# Altium project master.PrjPcb (part 2 of 3)

## Sheet mcu0_to_mcu1_isolated_SPI.SchDoc: foxBMS BMS-Master
size A3; DocumentNumber: 12; SheetNumber: 12; SheetTotal: 24; Author: Fraunhofer IISB foxBMS Team; REL-DATE: 2017-05-16; VERSION: 1.0.2; SheetDescription: Isolated Bidirectional Interface MCU0/MCU1
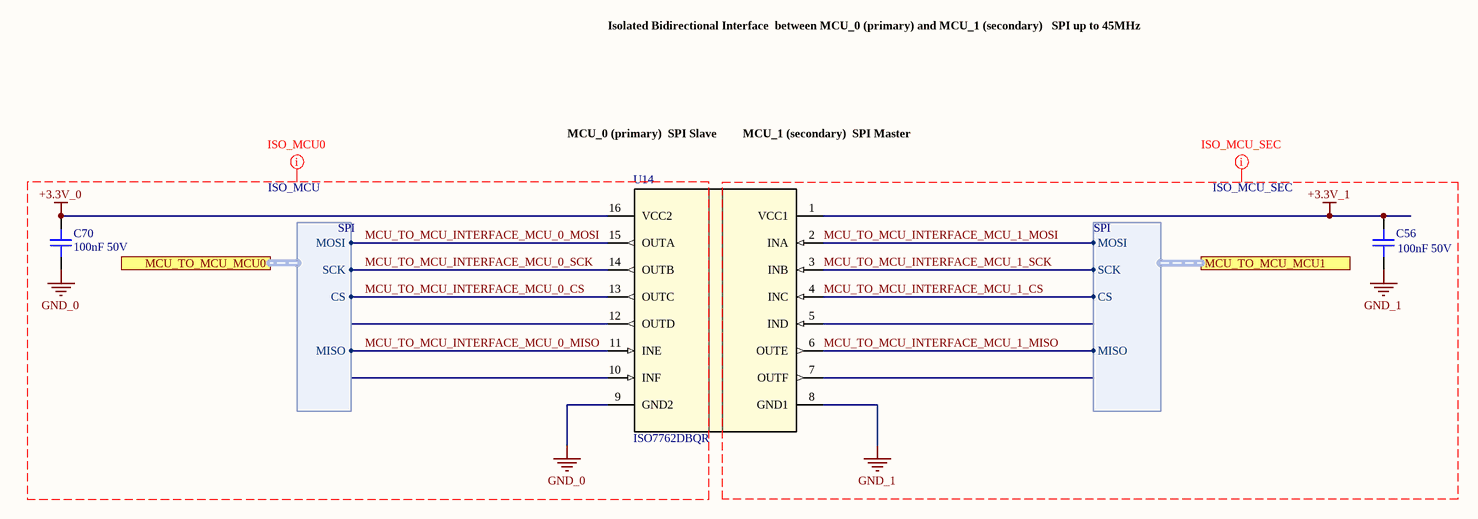
[diagram p7: mcu0_to_mcu1_isolated_SPI.SchDoc]

### Parts
C56  100nF 50V  [0603C]
C70  100nF 50V  [0603C]
U14  ISO7762DBQR  [DBQ0016A_N]

### Ports
MCU_TO_MCU_MCU0 (harness SPI), MCU_TO_MCU_MCU1 (harness SPI)

### Harnesses
SPI: CS, MISO, MOSI, SCK

### Nets
+3.3V_0: C70.2 U14.16(VCC2)
+3.3V_1: C56.1 U14.1(VCC1)
GND_0: C70.1 U14.9(GND2)
GND_1: C56.2 U14.8(GND1)
MCU_TO_MCU_INTERFACE_MCU_0_CS: U14.13(OUTC) ; port MCU_TO_MCU_MCU0.CS
MCU_TO_MCU_INTERFACE_MCU_0_MISO: U14.11(INE) ; port MCU_TO_MCU_MCU0.MISO
MCU_TO_MCU_INTERFACE_MCU_0_MOSI: U14.15(OUTA) ; port MCU_TO_MCU_MCU0.MOSI
MCU_TO_MCU_INTERFACE_MCU_0_SCK: U14.14(OUTB) ; port MCU_TO_MCU_MCU0.SCK
MCU_TO_MCU_INTERFACE_MCU_1_CS: U14.4(INC) ; port MCU_TO_MCU_MCU1.CS
MCU_TO_MCU_INTERFACE_MCU_1_MISO: U14.6(OUTE) ; port MCU_TO_MCU_MCU1.MISO
MCU_TO_MCU_INTERFACE_MCU_1_MOSI: U14.2(INA) ; port MCU_TO_MCU_MCU1.MOSI
MCU_TO_MCU_INTERFACE_MCU_1_SCK: U14.3(INB) ; port MCU_TO_MCU_MCU1.SCK

Not connected (* = marked no-connect by the designer): U14 5(IND) 7(OUTF) 10(INF) 12(OUTD)

### Layout directives
net class ISO_MCU_SEC: +3.3V_1, GND_1, MCU_TO_MCU_INTERFACE_MCU_1_CS, MCU_TO_MCU_INTERFACE_MCU_1_MISO, MCU_TO_MCU_INTERFACE_MCU_1_MOSI, MCU_TO_MCU_INTERFACE_MCU_1_SCK
net class ISO_MCU: +3.3V_0, GND_0, MCU_TO_MCU_INTERFACE_MCU_0_CS, MCU_TO_MCU_INTERFACE_MCU_0_MISO, MCU_TO_MCU_INTERFACE_MCU_0_MOSI, MCU_TO_MCU_INTERFACE_MCU_0_SCK

### Notes on the sheet
- Isolated Bidirectional Interface
  between MCU_0 (primary) and MCU_1 (secondary)
  SPI up to 45MHz
- MCU_0 (primary)
  SPI Slave
- MCU_1 (secondary)
  SPI Master
- Fraunhofer IISB
- Schottkystr. 10
- developed by:
- 91058 Erlangen
- Germany
- Author
- Project
- License
- Description
- File
- Version
- Release Date
- Sheet
- www.foxbms.org
- www.iisb.fraunhofer.de
- foxBMS Team
- /

### Library data of the parts
C56 C70 = gen_C_ceramic_100n_50V_X7R_0603: as C128 on sheet FPGA_SPI_interface; Rated Voltage: 50V; Dielectric: X7R; Supplier 1: Digi-Key; Supplier Part Number 1: 490-5798-1-ND; Height - Seated (Max): 0.8mm; Mounting Type: SurfaceMount,MLCC; Operating Temperature: –55 to 125°C; Series: GCJ; Tolerance: ±10%; Manufacturer_Part_Number: GCJ188R71H104KA12
U14 = ISO7762DBQR: Imported; Manufacturer: Texas Instruments; PartNumber: ISO7760DBQR; RefDes: RefDes; TYPE: TYPE; Value: Value

## Sheet isolated_USB.SchDoc: foxBMS BMS-Master
size A3; DocumentNumber: 19; SheetNumber: 19; SheetTotal: 24; Author: Fraunhofer IISB foxBMS Team; REL-DATE: 2017-05-16; VERSION: 1.0.2; SheetDescription: Isolated USB MCU_0 + MCU_1
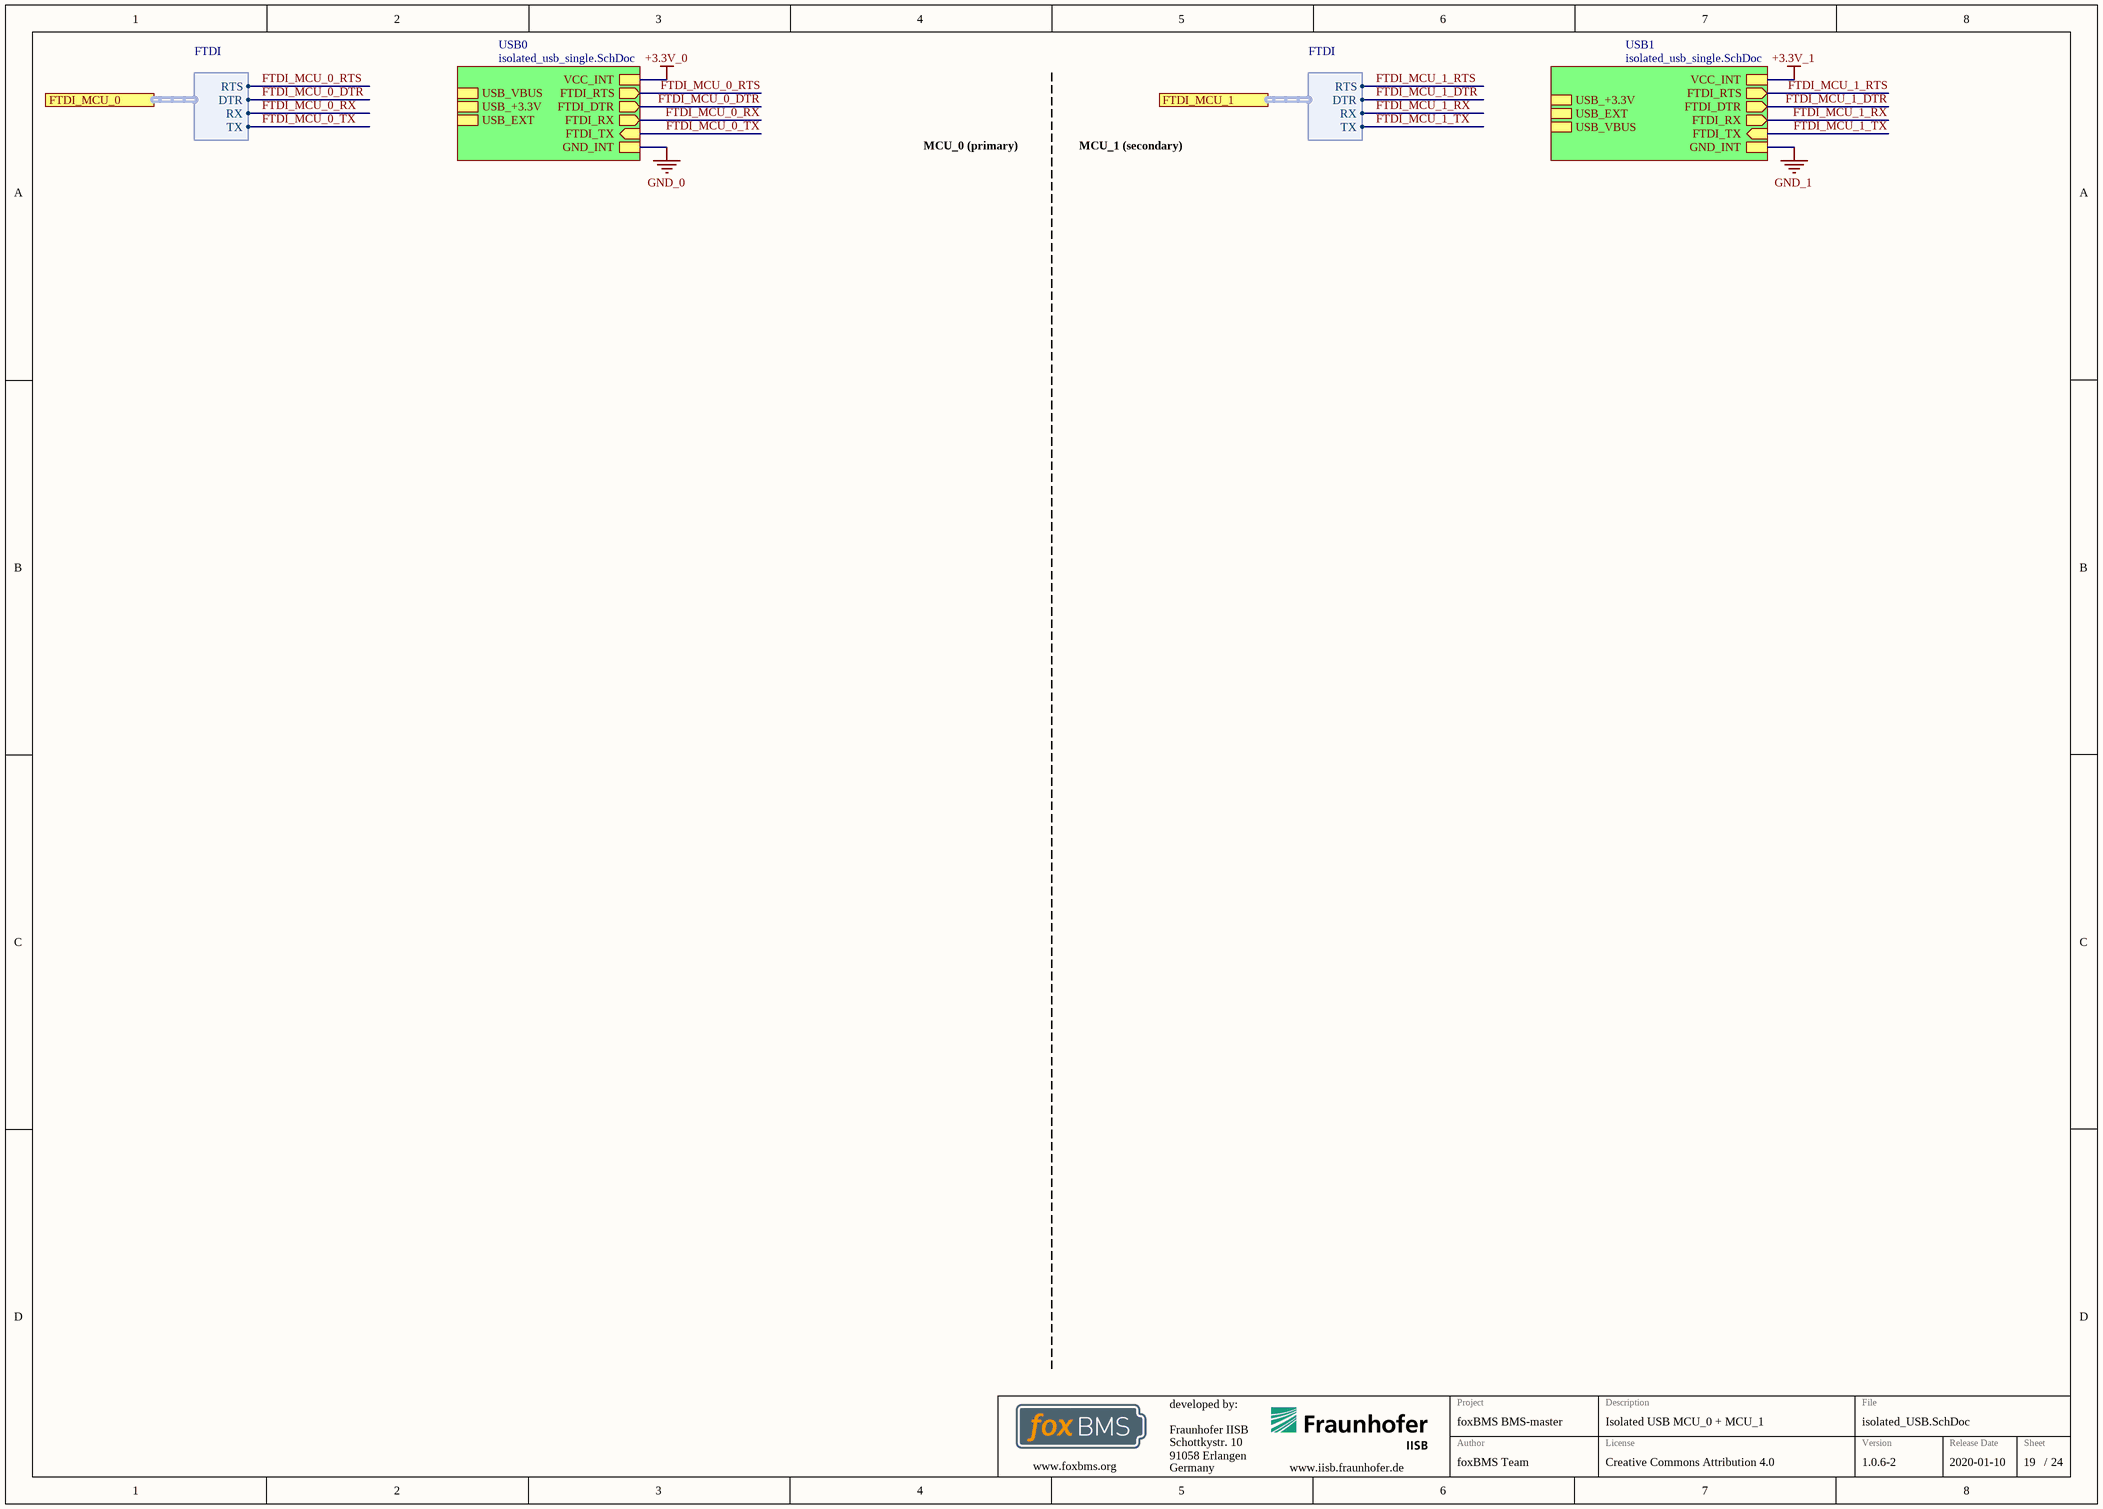
[diagram p8: isolated_USB.SchDoc]

### Sub-sheets
USB0 = isolated_usb_single.SchDoc (file not in this document): FTDI_TX (in), FTDI_RX (out), FTDI_DTR (out), FTDI_RTS (out), VCC_INT, GND_INT, USB_VBUS, USB_+3.3V, USB_EXT
USB1 = isolated_usb_single.SchDoc (file not in this document): FTDI_TX (in), FTDI_RX (out), FTDI_DTR (out), FTDI_RTS (out), VCC_INT, GND_INT, USB_+3.3V, USB_EXT, USB_VBUS

### Ports
FTDI_MCU_0 (harness FTDI), FTDI_MCU_1 (harness FTDI)

### Harnesses
FTDI: RTS, DTR, RX, TX

### Nets
FTDI_MCU_0_DTR: sheet USB0/FTDI_DTR, port FTDI_MCU_0.DTR
FTDI_MCU_0_RTS: sheet USB0/FTDI_RTS, port FTDI_MCU_0.RTS
FTDI_MCU_0_RX: sheet USB0/FTDI_RX, port FTDI_MCU_0.RX
FTDI_MCU_0_TX: sheet USB0/FTDI_TX, port FTDI_MCU_0.TX
FTDI_MCU_1_DTR: sheet USB1/FTDI_DTR, port FTDI_MCU_1.DTR
FTDI_MCU_1_RTS: sheet USB1/FTDI_RTS, port FTDI_MCU_1.RTS
FTDI_MCU_1_RX: sheet USB1/FTDI_RX, port FTDI_MCU_1.RX
FTDI_MCU_1_TX: sheet USB1/FTDI_TX, port FTDI_MCU_1.TX

### Notes on the sheet
- MCU_0 (primary)
- MCU_1 (secondary)
- Fraunhofer IISB
- Schottkystr. 10
- developed by:
- 91058 Erlangen
- Germany
- Author
- Project
- License
- Description
- File
- Version
- Release Date
- Sheet
- www.foxbms.org
- www.iisb.fraunhofer.de
- foxBMS Team
- /

## Sheet mcu1_secondary.SchDoc: foxBMS BMS-Master
size A3; DocumentNumber: 11; SheetNumber: 11; SheetTotal: 24; Author: Fraunhofer IISB foxBMS Team; REL-DATE: 2017-05-16; VERSION: 1.0.2; SheetDescription: MCU1 (Secondary); ClassName: ISO_MCU_SEC
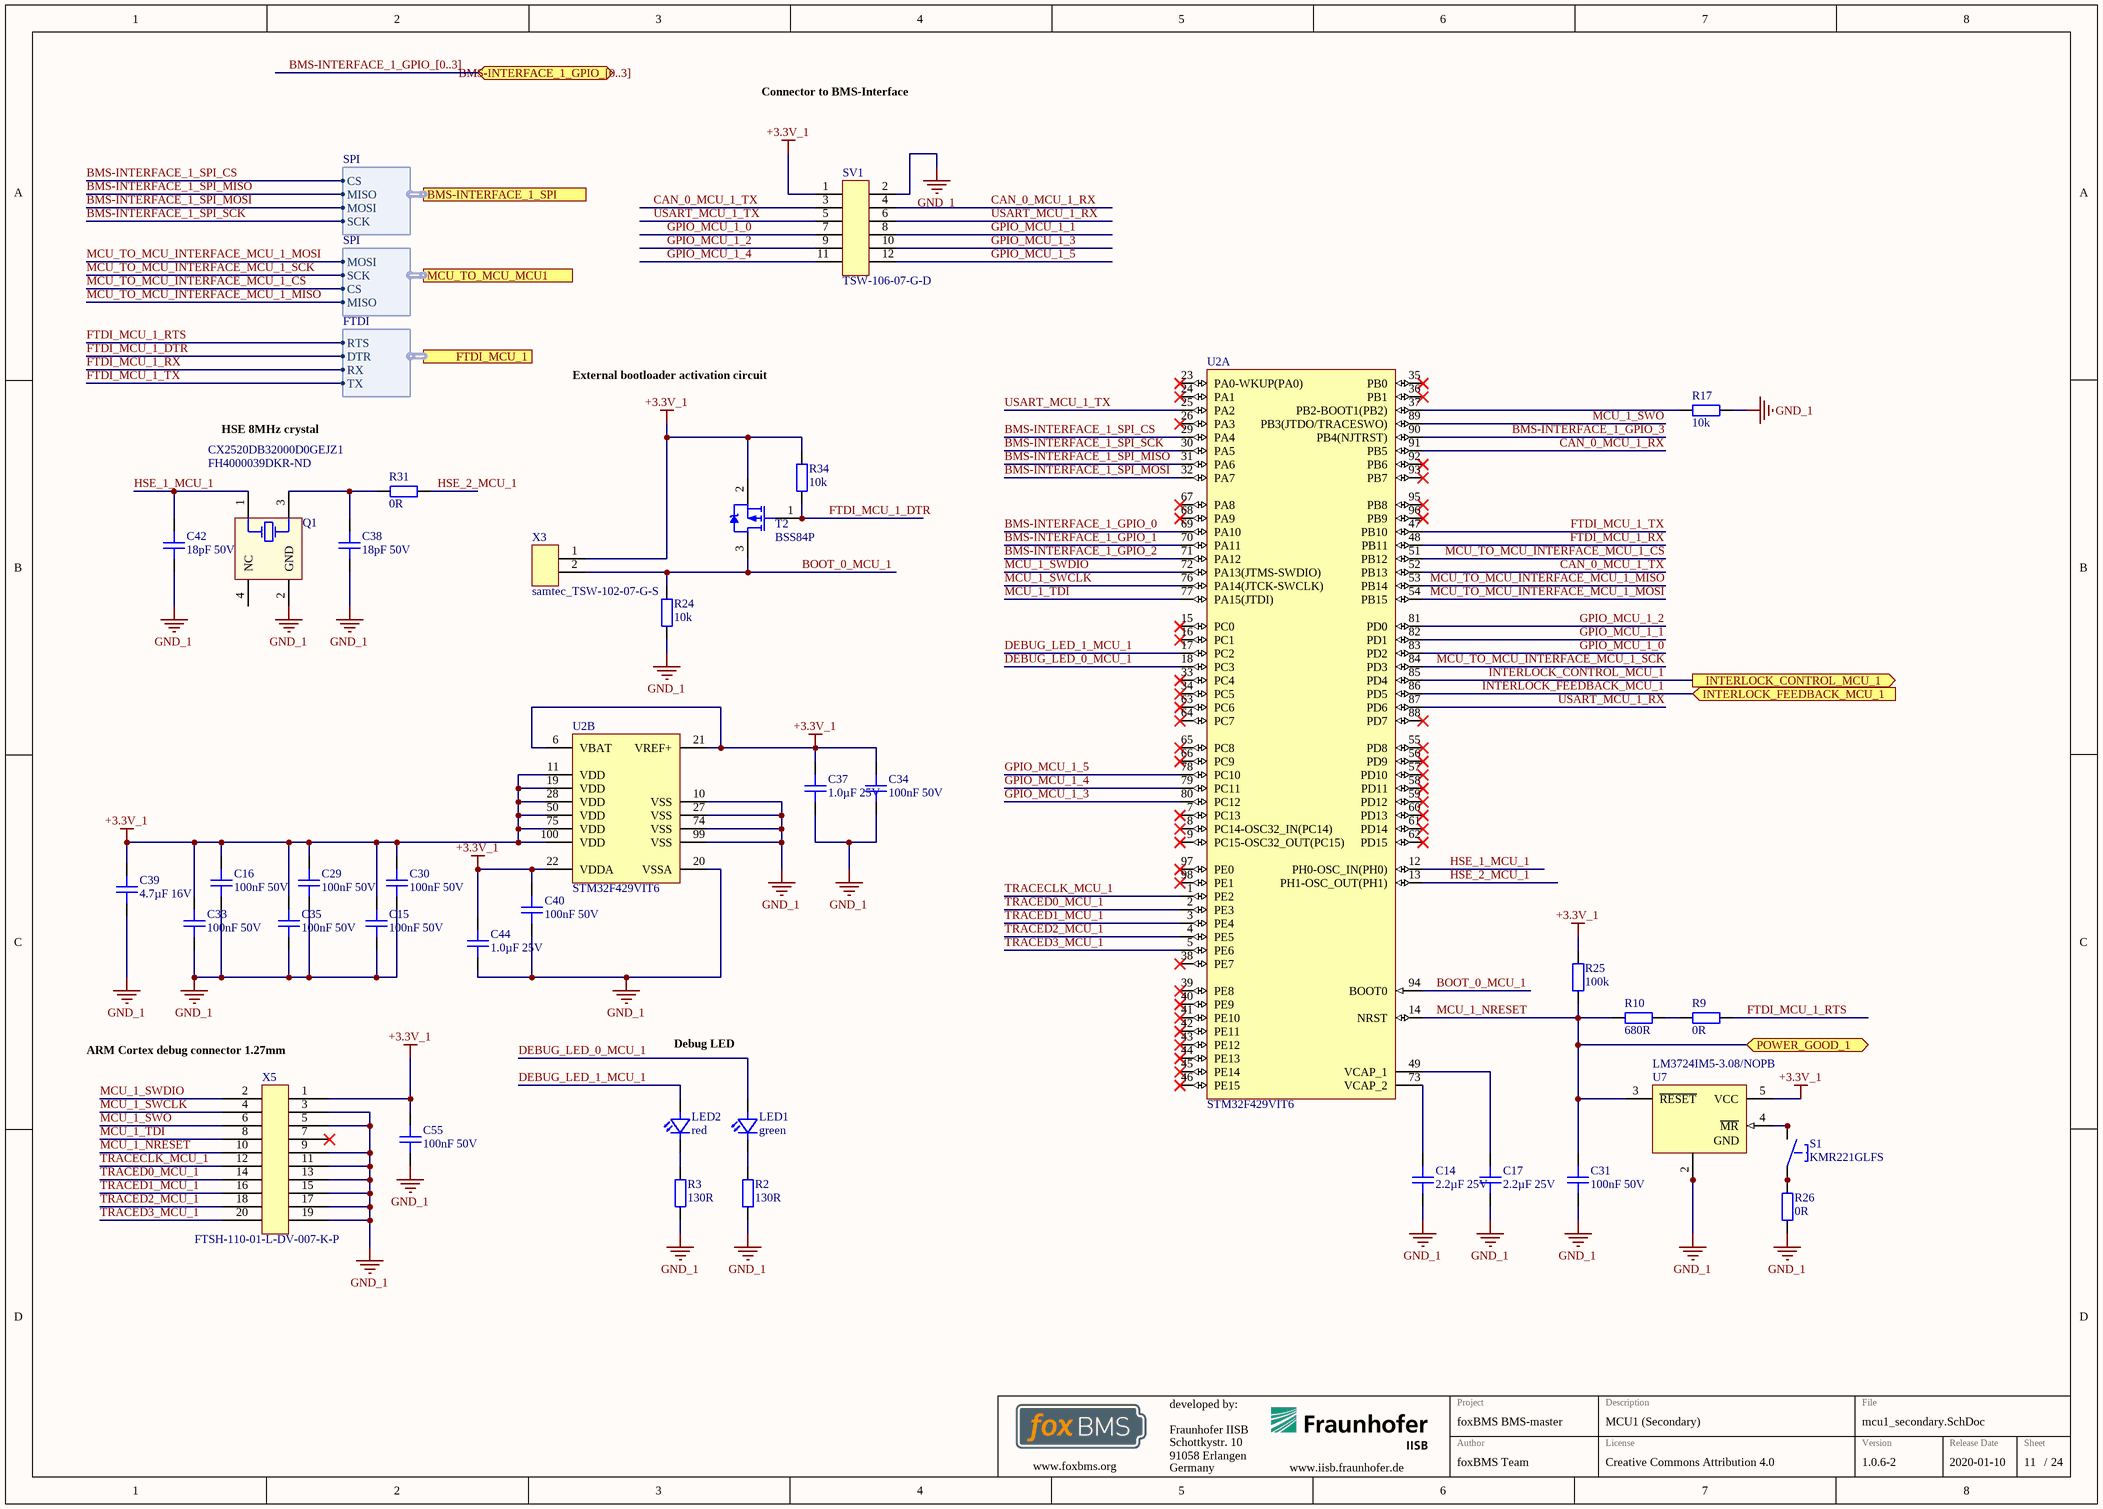
[diagram p9: mcu1_secondary.SchDoc]

### Parts
C14  2.2µF 25V  [0805C]
C15  100nF 50V  [0402C]
C16  100nF 50V  [0402C]
C17  2.2µF 25V  [0805C]
C29  100nF 50V  [0402C]
C30  100nF 50V  [0402C]
C31  100nF 50V  [0603C]
C33  100nF 50V  [0402C]
C34  100nF 50V  [0402C]
C35  100nF 50V  [0402C]
C37  1.0µF 25V  [0603C]
C38  18pF 50V  [0402C]
C39  4.7µF 16V  [0805C]
C40  100nF 50V  [0402C]
C42  18pF 50V  [0402C]
C44  1.0µF 25V  [0603C]
C55  100nF 50V  [0603C]
LED1  green  [LEDC1608X07N]
LED2  red  [LEDC1608X07N]
Q1  CX2520DB32000D0GEJZ1  Supplier Part Number 1: FH4000039DKR-ND  [AVX-CX2520DB32000D0GEJZ1-4_V]
R2  130R  [0603R]
R3  130R  [0603R]
R9  0R  [0603R]
R10  680R  [0603R]
R17  10k  [0603R]
R24  10k  [0603R]
R25  100k  [0603R]
R26  0R  [0603R]
R31  0R  [0402R]
R34  10k  [0603R]
S1  KMR221GLFS  [KMR2_Series]
SV1  TSW-106-07-G-D  [Pinheader_2.54_2x6]
T2  BSS84P  [INF-PG-SOT23_N]
U2  STM32F429VIT6  [STM-LQFP100_N]  (parts A,B of 2)
U7  LM3724IM5-3.08/NOPB  [MF05A_N]
X3  samtec_TSW-102-07-G-S  [Pinheader_2.54_2]
X5  FTSH-110-01-L-DV-007-K-P  [CORTEX_DEBUG_20_PIN]

### Ports
BMS-INTERFACE_1_GPIO_[0..3] (bidir), BMS-INTERFACE_1_SPI (harness SPI), FTDI_MCU_1 (harness FTDI), INTERLOCK_CONTROL_MCU_1 (out), INTERLOCK_FEEDBACK_MCU_1 (in), MCU_TO_MCU_MCU1 (harness SPI), POWER_GOOD_1 (bidir)

### Harnesses
SPI: CS, MISO, MOSI, SCK
FTDI: RTS, DTR, RX, TX

### Nets
+3.3V_1: C15.1 C16.1 C29.1 C30.1 C33.1 C34.1 C35.1 C37.1 C39.1 C40.1 C44.1 C55.1 R25.2 R34.2 SV1.1 T2.2(SOURCE) U2.6(VBAT) U2.11(VDD) U2.19(VDD) U2.21(VREF+) U2.22(VDDA) U2.28(VDD) U2.50(VDD) U2.75(VDD) U2.100(VDD) U7.5(VCC) X3.1 X5.1
GND_1: C14.2 C15.2 C16.2 C17.2 C29.2 C30.2 C31.2 C33.2 C34.2 C35.2 C37.2 C38.2 C39.2 C40.2 C42.1 C44.2 C55.2 Q1.2(GND) R2.1 R3.1 R17.1 R24.1 R26.1 SV1.2 U2.10(VSS) U2.20(VSSA) U2.27(VSS) U2.74(VSS) U2.99(VSS) U7.1(GND) U7.2(GND) X5.3 X5.5 X5.9 X5.11 X5.13 X5.15 X5.17 X5.19
BMS-INTERFACE_1_GPIO_0: U2.69(PA10)
BMS-INTERFACE_1_GPIO_1: U2.70(PA11)
BMS-INTERFACE_1_GPIO_2: U2.71(PA12)
BMS-INTERFACE_1_GPIO_3: U2.90(PB4(NJTRST))
BMS-INTERFACE_1_SPI_CS: U2.29(PA4) ; port BMS-INTERFACE_1_SPI.CS
BMS-INTERFACE_1_SPI_MISO: U2.31(PA6) ; port BMS-INTERFACE_1_SPI.MISO
BMS-INTERFACE_1_SPI_MOSI: U2.32(PA7) ; port BMS-INTERFACE_1_SPI.MOSI
BMS-INTERFACE_1_SPI_SCK: U2.30(PA5) ; port BMS-INTERFACE_1_SPI.SCK
BOOT_0_MCU_1: R24.2 T2.3(DRAIN) U2.94(BOOT0) X3.2
CAN_0_MCU_1_RX: SV1.4 U2.91(PB5)
CAN_0_MCU_1_TX: SV1.3 U2.52(PB13)
DEBUG_LED_0_MCU_1: LED1.2(A) U2.18(PC3)
DEBUG_LED_1_MCU_1: LED2.2(A) U2.17(PC2)
FTDI_MCU_1_DTR: R34.1 T2.1(GATE) ; port FTDI_MCU_1.DTR
FTDI_MCU_1_RTS: R9.2 ; port FTDI_MCU_1.RTS
FTDI_MCU_1_RX: U2.48(PB11) ; port FTDI_MCU_1.RX
FTDI_MCU_1_TX: U2.47(PB10) ; port FTDI_MCU_1.TX
GPIO_MCU_1_0: SV1.7 U2.83(PD2)
GPIO_MCU_1_1: SV1.8 U2.82(PD1)
GPIO_MCU_1_2: SV1.9 U2.81(PD0)
GPIO_MCU_1_3: SV1.10 U2.80(PC12)
GPIO_MCU_1_4: SV1.11 U2.79(PC11)
GPIO_MCU_1_5: SV1.12 U2.78(PC10)
HSE_1_MCU_1: C42.2 Q1.1(HOT) U2.12(PH0-OSC_IN(PH0))
HSE_2_MCU_1: R31.1 U2.13(PH1-OSC_OUT(PH1))
INTERLOCK_CONTROL_MCU_1: U2.85(PD4) ; port INTERLOCK_CONTROL_MCU_1
INTERLOCK_FEEDBACK_MCU_1: U2.86(PD5) ; port INTERLOCK_FEEDBACK_MCU_1
MCU_1_NRESET: C31.1 R10.1 R25.1 U2.14(NRST) U7.3(~{RESET}) X5.10 ; port POWER_GOOD_1
MCU_1_SWCLK: U2.76(PA14(JTCK-SWCLK)) X5.4
MCU_1_SWDIO: U2.72(PA13(JTMS-SWDIO)) X5.2
MCU_1_SWO: U2.89(PB3(JTDO/TRACESWO)) X5.6
MCU_1_TDI: U2.77(PA15(JTDI)) X5.8
MCU_TO_MCU_INTERFACE_MCU_1_CS: U2.51(PB12) ; port MCU_TO_MCU_MCU1.CS
MCU_TO_MCU_INTERFACE_MCU_1_MISO: U2.53(PB14) ; port MCU_TO_MCU_MCU1.MISO
MCU_TO_MCU_INTERFACE_MCU_1_MOSI: U2.54(PB15) ; port MCU_TO_MCU_MCU1.MOSI
MCU_TO_MCU_INTERFACE_MCU_1_SCK: U2.84(PD3) ; port MCU_TO_MCU_MCU1.SCK
TRACECLK_MCU_1: U2.1(PE2) X5.12
TRACED0_MCU_1: U2.2(PE3) X5.14
TRACED1_MCU_1: U2.3(PE4) X5.16
TRACED2_MCU_1: U2.4(PE5) X5.18
TRACED3_MCU_1: U2.5(PE6) X5.20
USART_MCU_1_RX: SV1.6 U2.87(PD6)
USART_MCU_1_TX: SV1.5 U2.25(PA2)
NetC14_1: C14.1 U2.73(VCAP_2)
NetC17_1: C17.1 U2.49(VCAP_1)
NetC38_1: C38.1 Q1.3(HOT) R31.2
NetLED1_1: LED1.1(C) R2.2
NetLED2_1: LED2.1(C) R3.2
NetR9_1: R9.1 R10.2
NetR17_2: R17.2 U2.37(PB2-BOOT1(PB2))
NetR26_2: R26.2 S1.1 S1.2
NetS1_3: S1.3 S1.4 U7.4(~{MR})

Not connected (* = marked no-connect by the designer): Q1 4(NC); U2 7(PC13)* 8(PC14-OSC32_IN(PC14))* 9(PC15-OSC32_OUT(PC15))* 15(PC0)* 16(PC1)* 23(PA0-WKUP(PA0))* 24(PA1)* 26(PA3)* 33(PC4)* 34(PC5)* 35(PB0)* 36(PB1)* 38(PE7)* 39(PE8)* 40(PE9)* 41(PE10)* 42(PE11)* 43(PE12)* 44(PE13)* 45(PE14)* 46(PE15)* 55(PD8)* 56(PD9)* 57(PD10)* 58(PD11)* 59(PD12)* 60(PD13)* 61(PD14)* 62(PD15)* 63(PC6)* 64(PC7)* 65(PC8)* 66(PC9)* 67(PA8)* 68(PA9)* 88(PD7)* 92(PB6)* 93(PB7)* 95(PB8)* 96(PB9)* 97(PE0)* 98(PE1)*; X5 7*

### Buses and harness runs
bus BMS-INTERFACE_1_GPIO_[0..3] = port BMS-INTERFACE_1_GPIO_[0..3]

### Notes on the sheet
- Connector to BMS-Interface
- External bootloader activation circuit
- HSE 8MHz crystal
- (near X5) ARM Cortex debug connector 1.27mm
- Debug LED
- Fraunhofer IISB
- Schottkystr. 10
- developed by:
- 91058 Erlangen
- Germany
- Author
- Project
- License
- Description
- File
- Version
- Release Date
- Sheet
- www.foxbms.org
- www.iisb.fraunhofer.de
- foxBMS Team
- /

### Library data of the parts
C14 C17 = gen_C_ceramic_2u2_50V_X7R_0805: Ceramic, 2.2µF, ±10%, 25V, X7R, –55 to 125°C, 0805 (2012),RoHS, Automotive; Part Number: GCJ21BR71E225KA01; Manufacturer: Murata; Capacitance: 2u2; Case EIA: 0805; Case Metric: 2012; Automotive Qualified: True; PnP Package: C_0805_10; PnP Value: 2.2µF/25V/X7R; Rated Voltage: 25V; Dielectric: X7R; Height - Seated (Max): 1.25mm; Mounting Type: SurfaceMount,MLCC; Operating Temperature: –55 to 125°C; Series: GCJ; Tolerance: ±10%; Manufacturer_Part_Number: GCJ21BR71E225KA01
C15 C16 C29 C30 C33-C35 = gen_C_ceramic_100n_50V_X7R_0402: Ceramic, 100nF, ±10%, 50V, X7R, –55 to 125°C, 0402 (1005),RoHS, Automotive; Part Number: GCM155R71H104KE02; Manufacturer: Murata; Capacitance: 100n; Case EIA: 0402; Case Metric: 1005; PnP Package: C_0402_10; PnP Value: 100nF/50V/X7R; Automotive Qualified: True; PnP equipped: x; Rated Voltage: 50V; Dielectric: X7R; Supplier 1: Digi-Key; Supplier Part Number 1: 490-10672-1-ND; Height - Seated (Max): 0.5mm; Mounting Type: SurfaceMount,MLCC; Operating Temperature: –55 to 125°C; Series: GCM; Tolerance: ±10%; Manufacturer_Part_Number: GCM155R71H104KE02
C31 C55 = gen_C_ceramic_100n_50V_X7R_0603: as C128 on sheet FPGA_SPI_interface; Rated Voltage: 50V; Dielectric: X7R; Supplier 1: Digi-Key; Supplier Part Number 1: 490-5798-1-ND; Height - Seated (Max): 0.8mm; Mounting Type: SurfaceMount,MLCC; Operating Temperature: –55 to 125°C; Series: GCJ; Tolerance: ±10%; Manufacturer_Part_Number: GCJ188R71H104KA12
C37 C44 = gen_C_ceramic_1u_25V_X7R_0603: as C122 on sheet power; Rated Voltage: 25V; Dielectric: X7R; Supplier 1: Digi-Key; Supplier Part Number 1: 490-14409-1-ND; Height - Seated (Max): 0.8mm; Mounting Type: SurfaceMount,MLCC; Operating Temperature: –55 to 125°C; Series: GCJ; Tolerance: ±10%; Manufacturer_Part_Number: GCJ188R71E105KA01
C38 C42 = gen_C_ceramic_18p_50V_C0G_0402: Ceramic, 18pF, ±5%, 50V, X7R, 25 to 125°C, 0402 (1005),RoHS, Automotive; Part Number: GCM1555C1H180JA16#; Manufacturer: Murata; Capacitance: 18p; Dielectric: C0G; Case EIA: 0402; Case Metric: 1005; Automotive Qualified: True; PnP Package: C_0402_10; PnP Value: 18pF/50V/X7R; Rated Voltage: 50V; Supplier 1: Digi-Key; Supplier Part Number 1: 490-12650-1-ND; Height - Seated (Max): 0.5mm; Mounting Type: SurfaceMount,MLCC; Operating Temperature: 25 to 125°C; Series: GCM; Tolerance: ±5%; Manufacturer_Part_Number: GCM1555C1H180JA16#
C39 = gen_C_ceramic_4u7_16V_X7R_0805: Ceramic, 4.7µF, ±10%, 16V, X7R, –55 to 125°C, 0805 (2012),RoHS, Automotive; Part Number: GCJ21BR71C475KA01; Manufacturer: Murata; Capacitance: 4u7; Case EIA: 0805; Case Metric: 2012; AVT Set: x; Automotive Qualified: True; PnP Package: C_0805_10; PnP Value: 4.7µF/16V/X7R; Rated Voltage: 16V; Dielectric: X7R; Supplier 1: Digi-Key; Supplier Part Number 1: 490-10557-1-ND; Height - Seated (Max): 1.25mm; Mounting Type: SurfaceMount,MLCC; Operating Temperature: –55 to 125°C; Series: GCJ; Tolerance: ±10%; Manufacturer_Part_Number: GCJ21BR71C475KA01
C40 = gen_C_ceramic_100n_50V_X7R_0402: Ceramic, 100nF, ±10%, 50V, X7R, –55 to 125°C, 0402 (1005),RoHS, Automotive; Part Number: GCM155R71H104KE02; Manufacturer: Murata; Capacitance: 100n; Case EIA: 0402; Case Metric: 1005; PnP Package: C_0402_10; PnP Value: 100nF/50V/X7R; PnP equipped: x; Automotive Qualified: True; Rated Voltage: 50V; Dielectric: X7R; Supplier 1: Digi-Key; Supplier Part Number 1: 490-10672-1-ND; Height - Seated (Max): 0.5mm; Mounting Type: SurfaceMount,MLCC; Operating Temperature: –55 to 125°C; Series: GCM; Tolerance: ±10%; Manufacturer_Part_Number: GCM155R71H104KE02
LED1 = gen_LED_0603_green: LED; Breakdown Voltage: 5V; Continuous Forward Current: 20mA; Forward Voltage @ 20mA: 2.2V; Automotive Qualified: False; Case EIA: 0603; Case Metric: 1608; Part Number: gen_LED_0603_green; Color: green; PnP Package: LED_0603; Supplier 1: Farnell; Supplier Part Number 1: 2099223
LED2 = gen_LED_0603_red: LED; Breakdown Voltage: 5V; Continuous Forward Current: 20mA; Forward Voltage @ 20mA: 2V; Automotive Qualified: False; Case EIA: 0603; Case Metric: 1608; Part Number: gen_LED_0603_red; Color: red; PnP Package: LED_0603; Supplier 1: Farnell; Supplier Part Number 1: 2099221
Q1 = CMP-0449-00001-1: Crystal,CRYSTAL 40MHZ 15PF 85degC Surface Mount 2.5 x 2.0 mm; Manufacturer: Kyocera; Drive Level: 10uW (100uW max.); Motional Series Resistance: 50 ohm (max); Frequency Range: 32000 kHz; Load Capacitance: 8 pF; Packing: Tape and Reel; ComponentLink2URL: http://global.kyocera.com/prdct/electro/pdf/xtal/cx2520db_cs_e.pdf; ComponentLink1Description: Manufacturer URL; PackageDescription: 4-Pin Hand Drawnï¼ŒBody 2.5x2mm; ComponentLink1URL: http://global.kyocera.com/; ComponentLink3URL: http://global.kyocera.com/prdct/electro/pdf/xtal/cx2520db_cs_e.pdf; ComponentLink2Description: Datasheet; PackageReference: CX2520DB32000D0GEJZ1-4; Operating Temperature: -10 to 70 degC; PartNumber: CX2520DB32000D0GEJZ1; ComponentLink3Description: Package Specification; Mounting Technology: Surface Mount; Supplier 1: Digi-Key
R2 R3 = gen_R_130R_0603: SMD Resistor 130R 0603; Tolerance: 1%; Power: 0.1W; Case EIA: 0603; Case Metric: 1608; Maximum Working Voltage: 75V; PnP Package: R_0603; Automotive Qualified: False; Part Number: gen_R_130R_0603; Operating Temperature: -55°C - +155°C; Resistance: 130R; Series: E24, E96; PnP Value: 130R; Supplier 1: Farnell; Supplier Part Number 1: 2379959
R9 R26 = gen_R_0R_0603: SMD Resistor 0R 0603; Power: 0.1W; Case EIA: 0603; Case Metric: 1608; PnP Package: R_0603; Maximum Working Voltage: 75V; Automotive Qualified: False; Part Number: gen_R_0R_0603; Operating Temperature: -55°C - +155°C; Resistance: 0R; Series: Jumper; PnP Value: 0R; Supplier 1: Farnell; Supplier Part Number 1: 2073345
R10 = gen_R_680R_0603: SMD Resistor 680R 0603; Tolerance: 1%; Power: 0.1W; Case EIA: 0603; Case Metric: 1608; Maximum Working Voltage: 75V; PnP Package: R_0603; Automotive Qualified: False; Part Number: gen_R_680R_0603; Operating Temperature: -55°C - +155°C; Resistance: 680R; Series: E24; PnP Value: 680R; Supplier 1: Farnell; Supplier Part Number 1: 2797303
R17 R24 R34 = gen_R_10k_0603: as R115 on sheet mcu0_primary; Part Number: gen_R_10k_0603; Operating Temperature: -55°C - +155°C; Resistance: 10k; Series: E24, E96; PnP Value: 10k; Supplier 1: Farnell; Supplier Part Number 1: 2073349
R25 = gen_R_100k_0603: as R58 on sheet mcu0_primary; Part Number: gen_R_100k_0603; Operating Temperature: -55°C - +155°C; PnP Value: 100k
R31 = gen_R_0R_0402: SMD Resistor 0R 0402; Case EIA: 0402; Case Metric: 1005; PnP Package: R_0402; Automotive Qualified: False; Part Number: gen_R_0R_0402; PnP Value: 0R; Operating Temperature: -55°C - +155°C
S1 = KMR221GLFS: Microminiature Tactile Switch; Manufacturer: CK Components; Automotive Qualified: False; Part Number: KMR221GLFS; Operating Temperature: -40°C - +85°C; ComponentLink1Description: Datasheet; ComponentLink1URL: http://www.farnell.com/datasheets/1685525.pdf; Supplier 1: Farnell; Supplier Part Number 1: 1201424; Supplier 2: Digikey; Supplier Part Number 2: 401-1426-1-ND; Supplier 3: Mouser; Supplier Part Number 3: 611-KMR211G-LFS
SV1 = samtec_TSW-106-07-G-D: Board-To-Board Connector, Vertical, 2.54 mm, 12 Contacts, Header, TSW Series, Through Hole, 2 Rows; Manufacturer: Samtec; Circuits: 12; Rated Voltage: 500V AC mated with SSW; Automotive Qualified: False; Part Number: TSW-106-07-G-D; Part Name: TSW-106-07-G-D; Operating Temperature: -55°C - +125°C; ComponentLink1Description: Datasheet; ComponentLink1URL: http://www.farnell.com/datasheets/1992055.pdf?_ga=2.196729640.569325269.1503285096-1413671594.1503025027; Supplier 1: Farnell; Supplier Part Number 1: 2025252
T2 = CMP-1099-00028-1: as T5 on sheet ext_bootload_activation; ComponentLink3URL: http://www.infineon.com/dgdl/SOT23-Package_Overview.pdf?folderId=db3a30431936bc4b0119532290053c66&fileId=db3a30431936bc4b0119533468123c85; ComponentLink3Description: Package Specification; Packing: Reel; PartNumber: BSS84P; ComponentLink2Description: Datasheet; Mounting Technology: Surface Mount; ComponentLink2URL: http://www.infineon.com/dgdl/BSS84P_Rev2.7%5B1%5D.pdf?folderId=db3a304314dca38901154a72e3951a65&fileId=db3a304330f68606013118ac7a9b4549; PackageReference: PG-SOT23; ComponentLink1URL: http://www.infineon.com/; PackageVersion: Apr-08; ComponentLink1Description: Manufacturer URL; PackageDescription: 3-Pin Small Outline Transistor Package, 2.9 x 1.3 mm Body, 0.95 mm Pitch; Halogen-free: TRUE; DatasheetVersion: Rev. 2.7; Part Number: BSS84P
U2 = CMP-0243-00030-2: ARM Cortex-M4 32-bit MCU+FPU, 225 DMIPS, 2048 kB Flash, 256 kB Internal RAM, 82 I/Os, 100-pin LQFP, -40 to 85 degC, Tray; Manufacturer: STMicroelectronics; FLASH Size (Prog) (kB): 2048; Supply Voltage(Vcc) min (V): 1.8; Operating Frequency(F) (Processor speed) (MHz): 180; Supply Voltage(Vcc) max (V): 3.6; D/A Converter: 2x12-bit; Internal RAM Size (kB): 256; I/Os (High Current): 82; Mounting Technology: Surface Mount; ComponentLink3URL: http://www.st.com/st-web-ui/static/active/en/resource/technical/document/data_brief/DM00071938.pdf; ComponentLink2URL: http://www.st.com/st-web-ui/static/active/en/resource/technical/document/data_brief/DM00053488.pdf; ComponentLink3Description: Package Specification; Packing: Tray; PackageDescription: 100-Pin Low Profile Quad Flat Package, 14 x 14 mm Body, 0.5 mm Pitch; PartNumber: STM32F429VIT6; ComponentLink2Description: Datasheet; ComponentLink1Description: Manufacturer URL; ComponentLink1URL: http://www.st.com/web/en/home.html; DatasheetVersion: Rev. 2; Core: ARM Cortex-M4; PackageReference: LQFP100; PackageVersion: Rev. 1, 06/2013; Part Number: STM32F429VIT6
U7 = CMP-0063-01088-2: 5-Pin Microprocessor Reset Circuits, 5-pin SOT-23, Pb-Free; Manufacturer: National Semiconductor; PowerWise: N; PackageTopMarking: R53B*XTT; CompType: MiscPower; PackageVersion: revD, Aug-2008; ComponentLink3URL: http://www.national.com/packaging/folders/mf05a.html; ComponentLink2URL: http://www.national.com/pf/LM/LM3724.html; PinCount: 5; ComponentLink2Description: LM3724 Web Page; PackageDescription: Molded SOT-23, .115 x .063 x .040 in Body, 5 Lead, .0375 in Pitch; ComponentLink3Description: MF05A Package Page; ComponentLink1Description: LM3724 Datasheet; RevisionNote: Component URLs added; RoHS: Y; ComponentLink1URL: http://www.national.com/ds/LM/LM3724.pdf; DatasheetVersion: Jul-2007; PackageReference: MF05A
X3 = samtec_TSW-102-07-G-S: as X10 on sheet ext_bootload_activation; Part Number: samtec_TSW-102-07-G-S; Part Name: TSW-102-07-G-S; Operating Temperature: -55°C - +125°C; ComponentLink1Description: Datasheet; ComponentLink1URL: http://www.farnell.com/datasheets/1796313.pdf; Supplier 1: Farnell; Supplier Part Number 1: 2505044
X5 = samtec_FTSH-110-01-L-DV-007-K-P: Board-To-Board Connector, ARM Cortex Debug Header 20 Pin; Manufacturer: Samtec; Circuits: 20; Automotive Qualified: False; Part Number: samtec_FTSH-110-01-L-DV-007-K-P; Part Name: FTSH-110-01-L-DV-007-K-P; Operating Temperature: -55°C - +125°C; Supplier 1: Digikey; Supplier Part Number 1: SAM11268-ND; Supplier 2: Avnet; Supplier Part Number 2: FTSH-110-01-L-DV-007-K-P

## Sheet connector_to_BMS_extension.SchDoc: foxBMS BMS-Master
size A3; DocumentNumber: 24; SheetNumber: 24; SheetTotal: 24; Author: Fraunhofer IISB foxBMS Team; REL-DATE: 2017-05-16; VERSION: 1.0.2; SheetDescription: Connectors to BMS-Extension
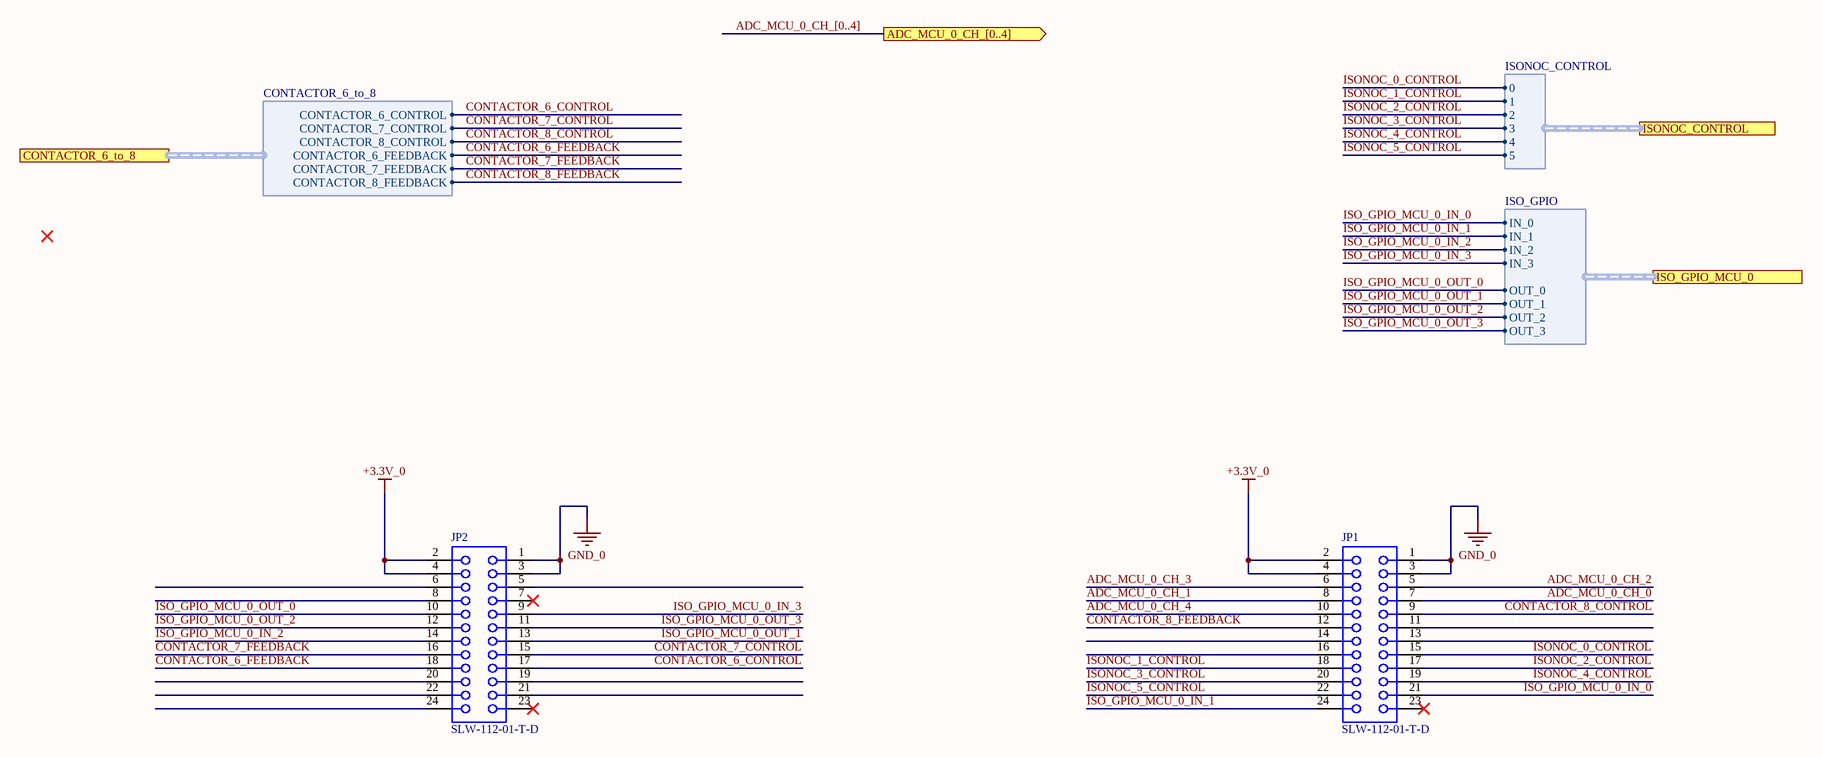
[diagram p10: connector_to_BMS_extension.SchDoc]

### Parts
JP1  SLW-112-01-T-D  [SMTC-SLW-112-01-X-D]
JP2  SLW-112-01-T-D  [SMTC-SLW-112-01-X-D]

### Ports
ADC_MCU_0_CH_[0..4] (out), CONTACTOR_6_to_8 (harness CONTACTOR_6_to_8), ISO_GPIO_MCU_0 (harness ISO_GPIO), ISONOC_CONTROL (harness ISONOC_CONTROL)

### Harnesses
CONTACTOR_6_to_8: CONTACTOR_6_CONTROL, CONTACTOR_7_CONTROL, CONTACTOR_8_CONTROL, CONTACTOR_6_FEEDBACK, CONTACTOR_7_FEEDBACK, CONTACTOR_8_FEEDBACK
ISONOC_CONTROL: 0, 1, 2, 3, 4, 5
ISO_GPIO: IN_0, IN_1, IN_2, IN_3, OUT_3, OUT_0, OUT_1, OUT_2

### Nets
+3.3V_0: JP1.2 JP1.4 JP2.2 JP2.4
GND_0: JP1.1 JP1.3 JP2.1 JP2.3
ADC_MCU_0_CH_0: JP1.7
ADC_MCU_0_CH_1: JP1.8
ADC_MCU_0_CH_2: JP1.5
ADC_MCU_0_CH_3: JP1.6
ADC_MCU_0_CH_4: JP1.10
CONTACTOR_6_CONTROL: JP2.17 ; port CONTACTOR_6_to_8.CONTACTOR_6_CONTROL
CONTACTOR_6_FEEDBACK: JP2.18 ; port CONTACTOR_6_to_8.CONTACTOR_6_FEEDBACK
CONTACTOR_7_CONTROL: JP2.15 ; port CONTACTOR_6_to_8.CONTACTOR_7_CONTROL
CONTACTOR_7_FEEDBACK: JP2.16 ; port CONTACTOR_6_to_8.CONTACTOR_7_FEEDBACK
CONTACTOR_8_CONTROL: JP1.9 ; port CONTACTOR_6_to_8.CONTACTOR_8_CONTROL
CONTACTOR_8_FEEDBACK: JP1.12 ; port CONTACTOR_6_to_8.CONTACTOR_8_FEEDBACK
ISO_GPIO_MCU_0_IN_0: JP1.21 ; port ISO_GPIO_MCU_0.IN_0
ISO_GPIO_MCU_0_IN_1: JP1.24 ; port ISO_GPIO_MCU_0.IN_1
ISO_GPIO_MCU_0_IN_2: JP2.14 ; port ISO_GPIO_MCU_0.IN_2
ISO_GPIO_MCU_0_IN_3: JP2.9 ; port ISO_GPIO_MCU_0.IN_3
ISO_GPIO_MCU_0_OUT_0: JP2.10 ; port ISO_GPIO_MCU_0.OUT_0
ISO_GPIO_MCU_0_OUT_1: JP2.13 ; port ISO_GPIO_MCU_0.OUT_1
ISO_GPIO_MCU_0_OUT_2: JP2.12 ; port ISO_GPIO_MCU_0.OUT_2
ISO_GPIO_MCU_0_OUT_3: JP2.11 ; port ISO_GPIO_MCU_0.OUT_3
ISONOC_0_CONTROL: JP1.15 ; port ISONOC_CONTROL.0
ISONOC_1_CONTROL: JP1.18 ; port ISONOC_CONTROL.1
ISONOC_2_CONTROL: JP1.17 ; port ISONOC_CONTROL.2
ISONOC_3_CONTROL: JP1.20 ; port ISONOC_CONTROL.3
ISONOC_4_CONTROL: JP1.19 ; port ISONOC_CONTROL.4
ISONOC_5_CONTROL: JP1.22 ; port ISONOC_CONTROL.5

Not connected (* = marked no-connect by the designer): JP1 11 13 14 16 23*; JP2 5 6 7* 8 19 20 21 22 23* 24

### Buses and harness runs
bus ADC_MCU_0_CH_[0..4] = port ADC_MCU_0_CH_[0..4]

### Notes on the sheet
- Fraunhofer IISB
- Schottkystr. 10
- developed by:
- 91058 Erlangen
- Germany
- Author
- Project
- License
- Description
- File
- Version
- Release Date
- Sheet
- www.foxbms.org
- www.iisb.fraunhofer.de
- foxBMS Team
- /

### Library data of the parts
JP1 JP2 = CMP-1023-00145-1: Low Profile Socket Strips, Through-hole, Vertical, -55 to 105 degC, 2.54 mm Pitch, 24-Pin, Female, RoHS; Manufacturer: Samtec; Pitch: 2.54 mm; System: Connector; DatasheetVersion: F-214; ComponentLink3Description: Package Specification; Orientation: Vertical; ComponentLink3URL: http://www.samtec.com/documents/webfiles/cpdf/SLW-1XX-01-X-X-MKT.pdf; ComponentLink1URL: http://www.samtec.com; Temperature Range: -55 to 105 degC; PackageReference: SLW-112-01-X-D; PartNumber: SLW-112-01-T-D; ComponentLink1Description: Manufacturer URL; PackageDescription: Low Profile Socket Strip; Mounting Technology: Through-hole; ComponentLink2Description: Datasheet; RoHS: True; ComponentLink2URL: http://www.samtec.com/documents/webfiles/pdf/SLW.PDF; PackageVersion: X, 9/1987; Part Number: SLW-112-01-T-D

## Sheet interlock_circuit.SchDoc: foxBMS BMS-Master
size A3; DocumentNumber: 15; SheetNumber: 15; SheetTotal: 24; Author: Fraunhofer IISB foxBMS Team; REL-DATE: 2017-05-16; VERSION: 1.0.2; SheetDescription: Interlock Circuit
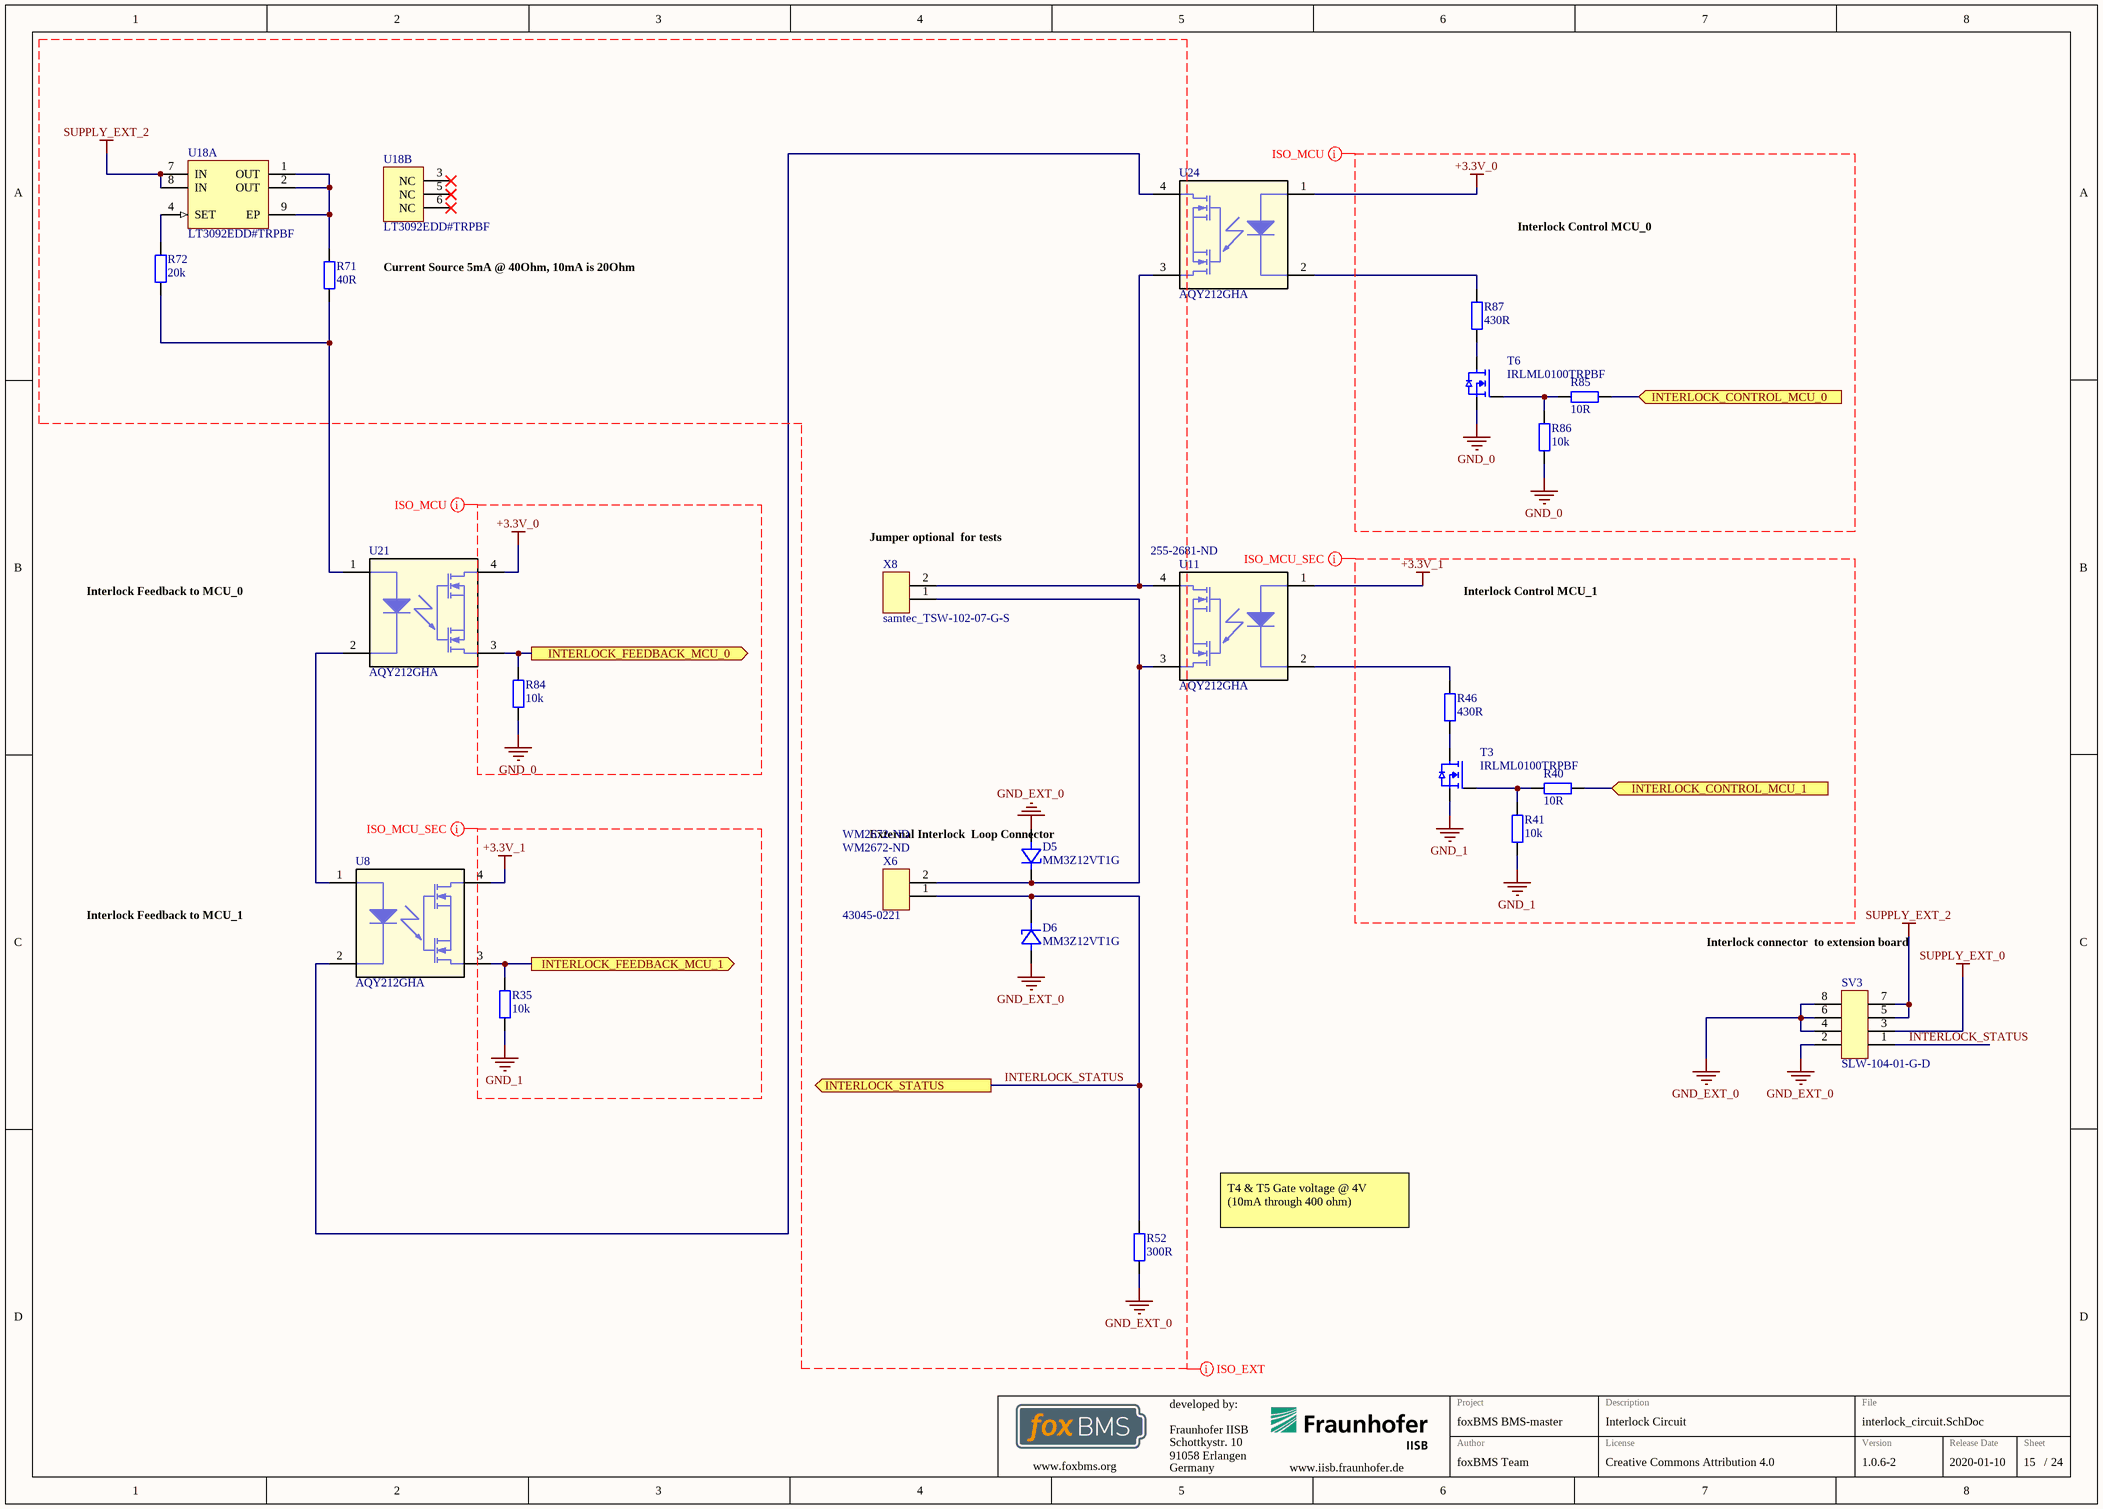
[diagram p11: interlock_circuit.SchDoc]

### Parts
D5  MM3Z12VT1G  [SODFL250X110-2N]
D6  MM3Z12VT1G  [SODFL250X110-2N]
R35  10k  [0603R]
R40  10R  [0603R]
R41  10k  [0603R]
R46  430R  [0603R]
R52  300R  [0805R]
R71  40R  [0805R]
R72  20k  [0805R]
R84  10k  [0603R]
R85  10R  [0603R]
R86  10k  [0603R]
R87  430R  [0603R]
SV3  SLW-104-01-G-D  [SLW_104_01_G_D]
T3  IRLML0100TRPBF  [SOT95P237X110-3N]
T6  IRLML0100TRPBF  [SOT95P237X110-3N]
U8  AQY212GHA  [PAN_AQY21-SO4]
U11  AQY212GHA  Supplier Part Number 1: 255-2681-ND  [PAN_AQY21-SO4]
U18  LT3092EDD#TRPBF  [LT-DD-8_V]  (parts A,B of 2)
U21  AQY212GHA  [PAN_AQY21-SO4]
U24  AQY212GHA  [PAN_AQY21-SO4]
X6  43045-0221  Supplier Part Number 1: WM2672-ND  [43045-0221]
X8  samtec_TSW-102-07-G-S  [Pinheader_2.54_2]

### Ports
INTERLOCK_CONTROL_MCU_0 (in), INTERLOCK_CONTROL_MCU_1 (in), INTERLOCK_FEEDBACK_MCU_0 (out), INTERLOCK_FEEDBACK_MCU_1 (out), INTERLOCK_STATUS (out)

### Nets
+3.3V_0: U21.4 U24.1
+3.3V_1: U8.4 U11.1
GND_0: R84.1 R86.2 T6.S
GND_1: R35.1 R41.2 T3.S
GND_EXT_0: D5.2(A) D6.2(A) R52.1 SV3.2 SV3.4 SV3.6 SV3.8  [project net GND_COM]
SUPPLY_EXT_0: SV3.3
SUPPLY_EXT_2: SV3.5 SV3.7 U18.7(IN) U18.8(IN)  [project net SUPPLY_ext]
INTERLOCK_CONTROL_MCU_0: R85.2 ; port INTERLOCK_CONTROL_MCU_0
INTERLOCK_CONTROL_MCU_1: R40.2 ; port INTERLOCK_CONTROL_MCU_1
INTERLOCK_FEEDBACK_MCU_0: R84.2 U21.3 ; port INTERLOCK_FEEDBACK_MCU_0
INTERLOCK_FEEDBACK_MCU_1: R35.2 U8.3 ; port INTERLOCK_FEEDBACK_MCU_1
INTERLOCK_STATUS: D6.1(K) R52.2 SV3.1 X6.1 ; port INTERLOCK_STATUS
NetD5_1: D5.1(K) U11.3 X6.2 X8.1
NetR40_1: R40.1 R41.1 T3.G
NetR46_1: R46.1 T3.D
NetR46_2: R46.2 U11.2
NetR71_1: R71.1 R72.1 U21.1
NetR71_2: R71.2 U18.1(OUT) U18.2(OUT) U18.9(EP)
NetR72_2: R72.2 U18.4(SET)
NetR85_1: R85.1 R86.1 T6.G
NetR87_1: R87.1 T6.D
NetR87_2: R87.2 U24.2
NetU8_1: U8.1 U21.2
NetU8_2: U8.2 U24.4
NetU11_4: U11.4 U24.3 X8.2

Not connected (* = marked no-connect by the designer): U18 3(NC)* 5(NC)* 6(NC)*

### Layout directives
net class ISO_MCU: +3.3V_0, GND_0
net class ISO_MCU_SEC: +3.3V_1, GND_1
net class ISO_EXT: GND_EXT_0, INTERLOCK_STATUS, SUPPLY_EXT_2

### Notes on the sheet
- Interlock Control MCU_0
- Current Source 5mA @ 40Ohm, 10mA is 20Ohm
- (near X8) Jumper optional
  for tests
- Interlock Feedback to MCU_0
- Interlock Control MCU_1
- (near D5) External Interlock
  Loop Connector
- Interlock Feedback to MCU_1
- Interlock connector
  to extension board
- T4 & T5 Gate voltage @ 4V (10mA through 400 ohm)
- Fraunhofer IISB
- Schottkystr. 10
- developed by:
- 91058 Erlangen
- Germany
- Author
- Project
- License
- Description
- File
- Version
- Release Date
- Sheet
- www.foxbms.org
- www.iisb.fraunhofer.de
- foxBMS Team
- /

### Library data of the parts
D5 D6 = MM3Z12VT1G: Zener Diode; Manufacturer: ON Semiconductor; Breakdown Voltage: 12V; PnP Package: SOD323; Automotive Qualified: True; Part Number: MM3Z12VT1G; Part Name: MM3Z12VT1G; Operating Temperature: *; Continuous Forward Current: *; ComponentLink1Description: Datasheet; ComponentLink1URL: http://www.farnell.com/datasheets/1876691.pdf; Supplier 1: Farnell; Supplier Part Number 1: 1431191; Supplier 2: Digikey; Supplier Part Number 2: MM3Z12VT1GOSCT-ND; Supplier 3: Mouser; Supplier Part Number 3: 863-MM3Z12VT1G
R35 R41 R84 R86 = gen_R_10k_0603: SMD Resistor 10k 0603; Tolerance: 1%; Power: 0.1W; Case EIA: 0603; Case Metric: 1608; Maximum Working Voltage: 75V; PnP Package: R_0603; Automotive Qualified: False; Part Number: gen_R_10k_0603; Operating Temperature: -55°C - +155°C; Resistance: 10k; Series: E24, E96; PnP Value: 10k; Supplier 1: Farnell; Supplier Part Number 1: 2073349
R40 R85 = gen_R_10R_0603: SMD Resistor 10R 0603; Tolerance: 1%; Power: 0.1W; Case EIA: 0603; Case Metric: 1608; Maximum Working Voltage: 75V; PnP Package: R_0603; Automotive Qualified: False; Part Number: gen_R_10R_0603; Operating Temperature: -55°C - +155°C; Resistance: 10R; Series: E24, E96; PnP Value: 10R; Supplier 1: Farnell; Supplier Part Number 1: 2073361
R46 R87 = gen_R_430R_0603: SMD Resistor 430R 0603; Tolerance: 1%; Power: 0.1W; Case EIA: 0603; Case Metric: 1608; Maximum Working Voltage: 75V; PnP Package: R_0603; Automotive Qualified: False; Part Number: gen_R_430R_0603; Operating Temperature: -55°C - +155°C; Resistance: 430R; Series: E24; PnP Value: 430R; Supplier 1: Farnell; Supplier Part Number 1: 2074259
R52 = gen_R_330R_0603: SMD Resistor 330R 0603; Part Number: gen_R_300R_0805; Power: 0.1W; Case EIA: 0805; Case Metric: 2012; Maximum Working Voltage: 75V; PnP Package: R_0603; Automotive Qualified: False; Operating Temperature: -55°C - +155°C; Resistance: 300R; Series: E24; PnP Value: 300R
R71 R72 = gen_R_120R_0603: SMD Resistor 120R 0603; Tolerance: 1%; Power: 0.1W; Case EIA: 0805; Case Metric: 2012; Maximum Working Voltage: 75V; PnP Package: R_0603; Automotive Qualified: False; Part Number: gen_R_120R_0603; Operating Temperature: -55°C - +155°C; Series: E24; PnP Value: 120R; Supplier 1: Farnell; Supplier Part Number 1: 2073369
  R71: Resistance: 40R
  R72: Resistance: 20k
SV3 = samtec_SLW-104-01-G-D: Board-To-Board Connector, Dual, 2.54 mm, 8 Contacts, Receptacle, SLW Series, Through Hole, 2 Rows; Manufacturer: Samtec; Circuits: 8; Rated Voltage: 406VAC Voltage rating; Rated Current: 5.2A; Automotive Qualified: False; Part Number: SLW-104-01-G-D; Part Name: SLW-104-01-G-D; Operating Temperature: -55°C - +125°C; ComponentLink1Description: Datasheet; ComponentLink1URL: http://www.farnell.com/datasheets/1927699.pdf; Supplier 1: Farnell; Supplier Part Number 1: 1668094; System: Connector
T3 T6 = IRLML0100TRPBF: MOSFET-Transistor, n-Kanal, 1.6 A, 100 V, 0.178 ohm, 10 V, 2.5 V; Manufacturer: Infineon; Maximum Drain-Source Voltage: 100V; Maximum Continous Drain Current (25°C): 1.6A; R_DS(on): 190m; Total Gate Charge: 2.5nC; Automotive Qualified: False; Part Number: IRLML0100TRPBF; Part Name: NMOS; Operating Temperature: -55°C - +150°C; ComponentLink1Description: Datasheet URL; ComponentLink1URL: http://www.farnell.com/datasheets/491501.pdf; Supplier 1: Farnell; Supplier Part Number 1: 1783928
U8 U11 U21 U24 = AQY212GHA: PhotoMOS GU 1 Form A, 60 V Load Voltage, 1.1 A Continuous Load Current, -40 to 85 degC, 4-Pin DIP(SMT), Tube, RoHS; Manufacturer: Panasonic; Pb-Free: True; Load Voltage: 60 V; Continuous Load Current: 1.1 A; On Resistance (Typ): 0.34 Ohm; ComponentLink1Description: Manufacturer URL; ComponentLink2Description: Datasheet; ComponentLink3Description: Package Specification; Series: PhotoMOS GU 1 Form A; ComponentLink3URL: http://www3.panasonic.biz/ac/e_download/control/relay/photomos/catalog/semi_eng_dimensions.pdf?f_cd=401560; DatasheetVersion: 201404-T; ComponentLink1URL: http://www3.panasonic.biz/ac/ae/index.jsp; Mounting Technology: Surface Mount; Packing: Tube; PackageVersion: ASCTB67E, 04/2014; PartNumber: AQY212GHA; PackageDescription: 4-Pin Surface Mount Terminal Package, Body 4.78 x 6.4 mm, Pitch 2.54mm; ComponentLink2URL: http://www3.panasonic.biz/ac/e_download/control/relay/photomos/catalog/semi_eng_gu1a_aqy21_g.pdf; RoHS: True; PackageReference: DIP4(SMT); Part Number: AQY212GHA
  U11: Supplier 1: Digi-Key
U18 = CMP-0472-00014-1: 200 mA Two-Terminal Programmable Current Source, 0.3 mA Isupply, 8-pin SON (DD-8), -40 to 125 degC, Pb-Free, Tape and Reel; Manufacturer: Linear Technology; Extended Temp: E, I, MP; Initial Accuracy(%): 1; Output Current Range: 0.5 mA to 200 mA; Vin Max(V): 40; Vin Min(V): 1.2; Isupply(mA): 0.3; DatasheetVersion: Rev. B; PackageDescription: 8-Pin Plastic DFN, Body 3 x 3 mm, Pitch 0.5 mm; ComponentLink2Description: Datasheet; ComponentLink1URL: http://www.linear.com/; Code_JEDEC: MO-229; ComponentLink2URL: http://cds.linear.com/docs/en/datasheet/3092fb.pdf; Mounting Technology: Surface Mount; ComponentLink1Description: Manufacturer URL; ComponentLink3Description: Package Specification; Packing: Tape and Reel; PackageReference: DD-8; ComponentLink3URL: http://cds.linear.com/docs/en/packaging/DFN_8_05-08-1698.pdf; PartNumber: LT3092EDD#TRPBF; RoHS: TRUE; PackageVersion: Jun-10; PartId: 1
X6 = molex_microfit_3_01x2_THT: Micro-Fit 3.0 Right Angle Header, 3.00mm Pitch, Dual Row, 2 Circuits, with Snap-in Plastic Peg PCB Lock, Tin, Glow Wire Capable, Black, 43045-0200; Manufacturer: Molex; Circuits: 2; Rated Voltage: 600V; Rated Current: 8.5A; Automotive Qualified: False; Part Number: molex_microfit_3_01x2_THT; Part Name: MicroFit; Operating Temperature: -40°C - +105°C; Supplier 1: Digi-Key; Supplier 2: Digi-Key; Supplier Part Number 2: WM2672-ND
X8 = samtec_TSW-102-07-G-S: Board-To-Board Connector, Vertical, 2.54 mm, 2 Contacts, Header, TSW Series, Through Hole, 1 Row; Manufacturer: Samtec; Circuits: 2; Automotive Qualified: False; Part Number: samtec_TSW-102-07-G-S; Part Name: TSW-102-07-G-S; Operating Temperature: -55°C - +125°C; ComponentLink1Description: Datasheet; ComponentLink1URL: http://www.farnell.com/datasheets/1796313.pdf; Supplier 1: Farnell; Supplier Part Number 1: 2505044

## Sheet contactor_control.SchDoc: foxBMS BMS-Master
size A3; DocumentNumber: 16; SheetNumber: 16; SheetTotal: 24; Author: Fraunhofer IISB foxBMS Team; REL-DATE: 2017-05-16; VERSION: 1.0.2; SheetDescription: Contactor Control
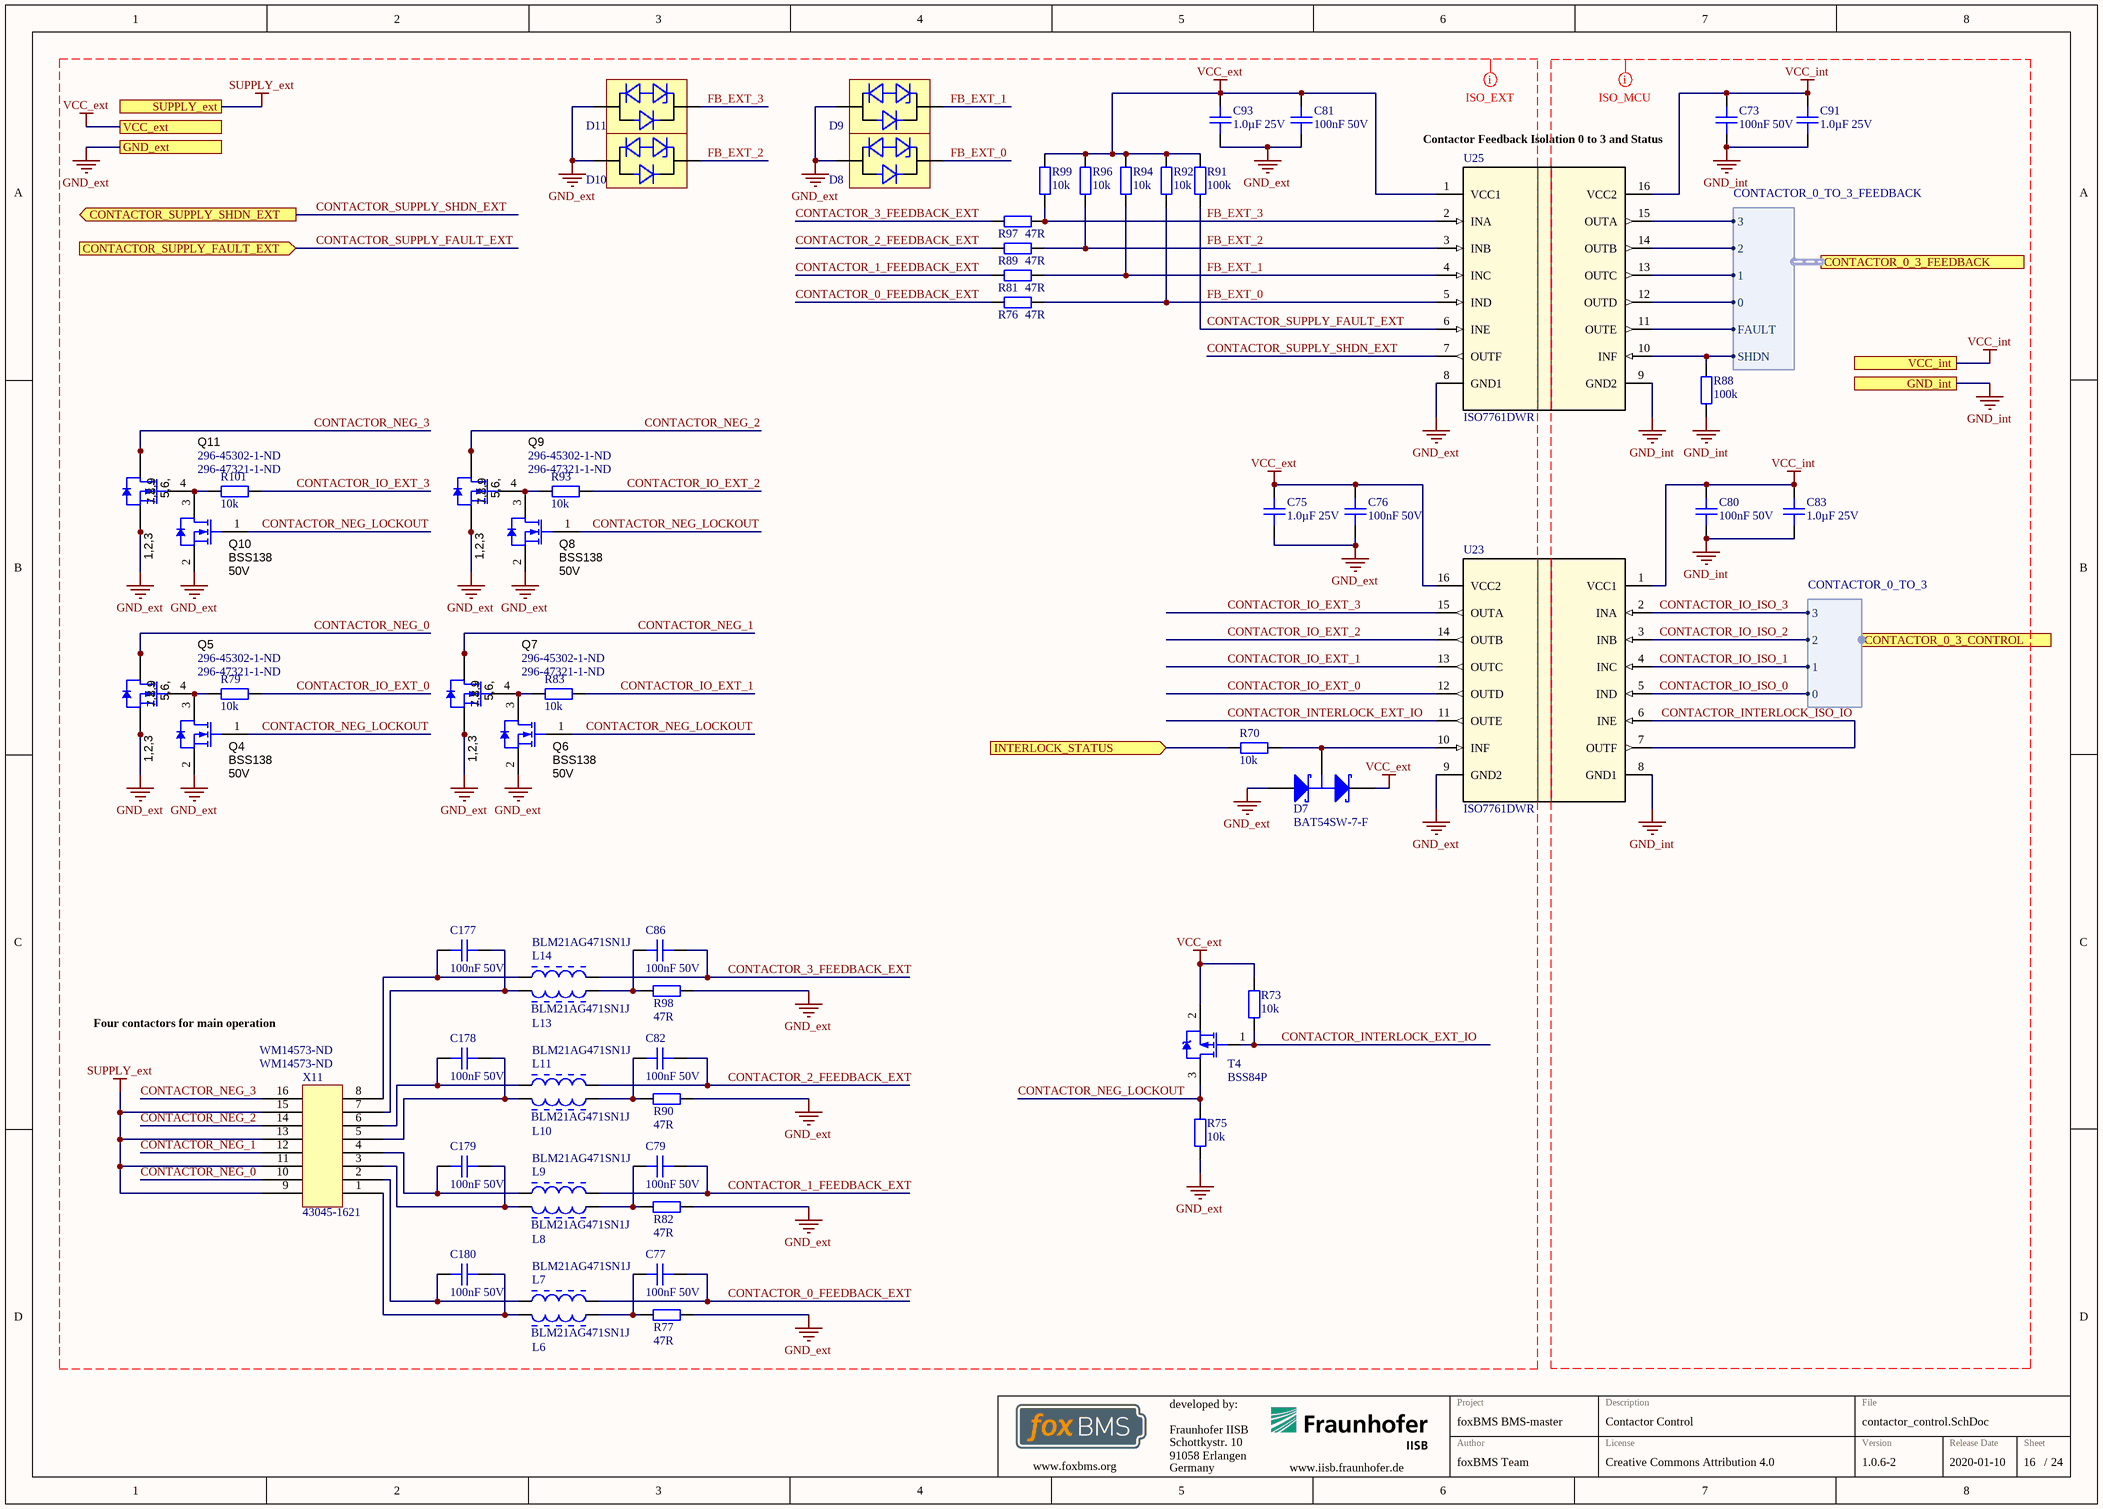
[diagram p12: contactor_control.SchDoc]

### Parts
C73  100nF 50V  [0603C]
C75  1.0µF 25V  [0603C]
C76  100nF 50V  [0603C]
C77  100nF 50V  [0603C]
C79  100nF 50V  [0603C]
C80  100nF 50V  [0603C]
C81  100nF 50V  [0603C]
C82  100nF 50V  [0603C]
C83  1.0µF 25V  [0603C]
C86  100nF 50V  [0603C]
C91  1.0µF 25V  [0603C]
C93  1.0µF 25V  [0603C]
C177  100nF 50V  [0603C]
C178  100nF 50V  [0603C]
C179  100nF 50V  [0603C]
C180  100nF 50V  [0603C]
D7  BAT54SW-7-F  [DIOD-SOT323-3_V]
D8  CDSOD323-T05  [SODFL250X110-2N]  (value not drawn)
D9  CDSOD323-T05  [SODFL250X110-2N]  (value not drawn)
D10  CDSOD323-T05  [SODFL250X110-2N]  (value not drawn)
D11  CDSOD323-T05  [SODFL250X110-2N]  (value not drawn)
L6  BLM21AG471SN1J  [MURA-BLM21-H1-CHIP-2_V]
L7  BLM21AG471SN1J  [MURA-BLM21-H1-CHIP-2_V]
L8  BLM21AG471SN1J  [MURA-BLM21-H1-CHIP-2_V]
L9  BLM21AG471SN1J  [MURA-BLM21-H1-CHIP-2_V]
L10  BLM21AG471SN1J  [MURA-BLM21-H1-CHIP-2_V]
L11  BLM21AG471SN1J  [MURA-BLM21-H1-CHIP-2_V]
L13  BLM21AG471SN1J  [MURA-BLM21-H1-CHIP-2_V]
L14  BLM21AG471SN1J  [MURA-BLM21-H1-CHIP-2_V]
Q4  BSS138  value 50V  [SOT-23]
Q5  Supplier Part Number 1: 296-45302-1-ND  Supplier Part Number 2: 296-47321-1-ND  [SONQ3A]  (hidden comment: CSD18543Q3A)
Q6  BSS138  value 50V  [SOT-23]
Q7  Supplier Part Number 1: 296-45302-1-ND  Supplier Part Number 2: 296-47321-1-ND  [SONQ3A]  (hidden comment: CSD18543Q3A)
Q8  BSS138  value 50V  [SOT-23]
Q9  Supplier Part Number 1: 296-45302-1-ND  Supplier Part Number 2: 296-47321-1-ND  [SONQ3A]  (hidden comment: CSD18543Q3A)
Q10  BSS138  value 50V  [SOT-23]
Q11  Supplier Part Number 1: 296-45302-1-ND  Supplier Part Number 2: 296-47321-1-ND  [SONQ3A]  (hidden comment: CSD18543Q3A)
R70  10k  [0603R]
R73  10k  [0603R]
R75  10k  [0603R]
R76  47R  [0603R]
R77  47R  [0603R]
R79  10k  [0603R]
R81  47R  [0603R]
R82  47R  [0603R]
R83  10k  [0603R]
R88  100k  [0603R]
R89  47R  [0603R]
R90  47R  [0603R]
R91  100k  [0603R]
R92  10k  [0603R]
R93  10k  [0603R]
R94  10k  [0603R]
R96  10k  [0603R]
R97  47R  [0603R]
R98  47R  [0603R]
R99  10k  [0603R]
R101  10k  [0603R]
T4  BSS84P  [INF-PG-SOT23_N]
U23  ISO7761DWR  [DW0016B_N]
U25  ISO7761DWR  [DW0016B_N]
X11  43045-1621  Supplier Part Number 1: WM14573-ND  [43045-1621]

### Ports
CONTACTOR_0_3_CONTROL (harness CONTACTOR_0_TO_3), CONTACTOR_0_3_FEEDBACK (harness CONTACTOR_0_TO_3_FEEDBACK), CONTACTOR_SUPPLY_FAULT_EXT (in), CONTACTOR_SUPPLY_SHDN_EXT (out), GND_ext, GND_int, INTERLOCK_STATUS (in), SUPPLY_ext, VCC_ext, VCC_int

### Harnesses
CONTACTOR_0_TO_3: 0, 1, 2, 3
CONTACTOR_0_TO_3_FEEDBACK: 0, 1, 2, 3, FAULT, SHDN

### Nets
GND_ext: C75.2 C76.2 C81.2 C93.2 D7.1(A) D8.2(A) D9.2(A) D10.2(A) D11.2(A) Q4.2(S) Q5.1(S) Q5.2(S) Q5.3(S) Q6.2(S) Q7.1(S) Q7.2(S) Q7.3(S) Q8.2(S) Q9.1(S) Q9.2(S) Q9.3(S) Q10.2(S) Q11.1(S) Q11.2(S) Q11.3(S) R75.1 R77.2 R82.2 R90.2 R98.2 U23.9(GND2) U25.8(GND1) ; port GND_ext  [project net GND_COM]
GND_int: C73.2 C80.2 C83.2 C91.2 R88.1 U23.8(GND1) U25.9(GND2) ; port GND_int  [project net GND_0]
SUPPLY_ext: X11.9 X11.11 X11.13 X11.15 ; port SUPPLY_ext
VCC_ext: C75.1 C76.1 C81.1 C93.1 D7.2(K) R73.2 R91.2 R92.2 R94.2 R96.2 R99.2 T4.2(SOURCE) U23.16(VCC2) U25.1(VCC1) ; port VCC_ext  [project net EXT_+3.3V_0]
VCC_int: C73.1 C80.1 C83.1 C91.1 U23.1(VCC1) U25.16(VCC2) ; port VCC_int  [project net +3.3V_0]
CONTACTOR_0_FEEDBACK: U25.12(OUTD) ; port CONTACTOR_0_3_FEEDBACK.0
CONTACTOR_0_FEEDBACK_EXT: C77.2 L7.2 R76.1
CONTACTOR_1_FEEDBACK: U25.13(OUTC) ; port CONTACTOR_0_3_FEEDBACK.1
CONTACTOR_1_FEEDBACK_EXT: C79.2 L9.2 R81.1
CONTACTOR_2_FEEDBACK: U25.14(OUTB) ; port CONTACTOR_0_3_FEEDBACK.2
CONTACTOR_2_FEEDBACK_EXT: C82.2 L11.2 R89.1
CONTACTOR_3_FEEDBACK: U25.15(OUTA) ; port CONTACTOR_0_3_FEEDBACK.3
CONTACTOR_3_FEEDBACK_EXT: C86.2 L14.2 R97.2
CONTACTOR_INTERLOCK_EXT_IO: R73.1 T4.1(GATE) U23.11(OUTE)
CONTACTOR_INTERLOCK_ISO_IO: U23.6(INE) U23.7(OUTF)
CONTACTOR_IO_EXT_0: R79.1 U23.12(OUTD)
CONTACTOR_IO_EXT_1: R83.1 U23.13(OUTC)
CONTACTOR_IO_EXT_2: R93.1 U23.14(OUTB)
CONTACTOR_IO_EXT_3: R101.1 U23.15(OUTA)
CONTACTOR_IO_ISO_0: U23.5(IND) ; port CONTACTOR_0_3_CONTROL.0  [project net CONTACTOR_0_CONTROL]
CONTACTOR_IO_ISO_1: U23.4(INC) ; port CONTACTOR_0_3_CONTROL.1  [project net CONTACTOR_1_CONTROL]
CONTACTOR_IO_ISO_2: U23.3(INB) ; port CONTACTOR_0_3_CONTROL.2  [project net CONTACTOR_2_CONTROL]
CONTACTOR_IO_ISO_3: U23.2(INA) ; port CONTACTOR_0_3_CONTROL.3  [project net CONTACTOR_3_CONTROL]
CONTACTOR_NEG_0: Q5.5(D) Q5.6(D) Q5.7(D) Q5.8(D) Q5.9(D) X11.10
CONTACTOR_NEG_1: Q7.5(D) Q7.6(D) Q7.7(D) Q7.8(D) Q7.9(D) X11.12
CONTACTOR_NEG_2: Q9.5(D) Q9.6(D) Q9.7(D) Q9.8(D) Q9.9(D) X11.14
CONTACTOR_NEG_3: Q11.5(D) Q11.6(D) Q11.7(D) Q11.8(D) Q11.9(D) X11.16
CONTACTOR_NEG_LOCKOUT: Q4.1(G) Q6.1(G) Q8.1(G) Q10.1(G) R75.2 T4.3(DRAIN)
CONTACTOR_SUPPLY_FAULT: U25.11(OUTE) ; port CONTACTOR_0_3_FEEDBACK.FAULT
CONTACTOR_SUPPLY_FAULT_EXT: R91.1 U25.6(INE) ; port CONTACTOR_SUPPLY_FAULT_EXT
CONTACTOR_SUPPLY_SHDN: R88.2 U25.10(INF) ; port CONTACTOR_0_3_FEEDBACK.SHDN
CONTACTOR_SUPPLY_SHDN_EXT: U25.7(OUTF) ; port CONTACTOR_SUPPLY_SHDN_EXT
FB_EXT_0: D8.1(K) R76.2 R92.1 U25.5(IND)
FB_EXT_1: D9.1(K) R81.2 R94.1 U25.4(INC)
FB_EXT_2: D10.1(K) R89.2 R96.1 U25.3(INB)
FB_EXT_3: D11.1(K) R97.1 R99.1 U25.2(INA)
INTERLOCK_STATUS: R70.2 ; port INTERLOCK_STATUS
NetC77_1: C77.1 L6.2 R77.1
NetC79_1: C79.1 L8.2 R82.1
NetC82_1: C82.1 L10.2 R90.1
NetC86_1: C86.1 L13.2 R98.1
NetC177_1: C177.1 L14.1 X11.8
NetC177_2: C177.2 L13.1 X11.7
NetC178_1: C178.1 L11.1 X11.6
NetC178_2: C178.2 L10.1 X11.5
NetC179_1: C179.1 L9.1 X11.4
NetC179_2: C179.2 L8.1 X11.3
NetC180_1: C180.1 L7.1 X11.2
NetC180_2: C180.2 L6.1 X11.1
NetD7_3: D7.3(C) R70.1 U23.10(INF)
NetQ4_3: Q4.3(D) Q5.4(G) R79.2
NetQ6_3: Q6.3(D) Q7.4(G) R83.2
NetQ8_3: Q8.3(D) Q9.4(G) R93.2
NetQ10_3: Q10.3(D) Q11.4(G) R101.2

### Layout directives
net class ISO_MCU: CONTACTOR_INTERLOCK_ISO_IO, CONTACTOR_IO_ISO_0, CONTACTOR_IO_ISO_1, CONTACTOR_IO_ISO_2, CONTACTOR_IO_ISO_3, GND_int, VCC_int
net class ISO_EXT: CONTACTOR_0_FEEDBACK_EXT, CONTACTOR_1_FEEDBACK_EXT, CONTACTOR_2_FEEDBACK_EXT, CONTACTOR_3_FEEDBACK_EXT, CONTACTOR_INTERLOCK_EXT_IO, CONTACTOR_IO_EXT_0, CONTACTOR_IO_EXT_1, CONTACTOR_IO_EXT_2, CONTACTOR_IO_EXT_3, CONTACTOR_NEG_0, CONTACTOR_NEG_1, CONTACTOR_NEG_2, CONTACTOR_NEG_3, CONTACTOR_NEG_LOCKOUT, CONTACTOR_SUPPLY_FAULT_EXT, CONTACTOR_SUPPLY_SHDN_EXT, FB_EXT_0, FB_EXT_1, FB_EXT_2, FB_EXT_3, GND_ext, SUPPLY_ext, VCC_ext

### Notes on the sheet
- (near C73) Contactor Feedback Isolation 0 to 3 and Status
- Four contactors for main operation
- Fraunhofer IISB
- Schottkystr. 10
- developed by:
- 91058 Erlangen
- Germany
- Author
- Project
- License
- Description
- File
- Version
- Release Date
- Sheet
- www.foxbms.org
- www.iisb.fraunhofer.de
- foxBMS Team
- /
- (in symbol CSD18543Q3A) 7,8,9; 5,6,; 1,2,3

### Library data of the parts
C73 C76 C77 C79-C82 C86 C177-C180 = gen_C_ceramic_100n_50V_X7R_0603: Ceramic, 100nF, ±10%, 50V, X7R, –55 to 125°C, 0603 (1608),RoHS, Automotive; Part Number: GCJ188R71H104KA12; Manufacturer: Murata; Capacitance: 100n; Case EIA: 0603; Case Metric: 1608; PnP Package: C_0603_10; PnP Value: 100nF/50V/X7R; PnP equipped: x; Automotive Qualified: True; Rated Voltage: 50V; Dielectric: X7R; Supplier 1: Digi-Key; Supplier Part Number 1: 490-5798-1-ND; Height - Seated (Max): 0.8mm; Mounting Type: SurfaceMount,MLCC; Operating Temperature: –55 to 125°C; Series: GCJ; Tolerance: ±10%; Manufacturer_Part_Number: GCJ188R71H104KA12
C75 C83 C91 C93 = gen_C_ceramic_1u_25V_X7R_0603: Ceramic, 1.0µF, ±10%, 25V, X7R, –55 to 125°C, 0603 (1608),RoHS, Automotive; Part Number: GCJ188R71E105KA01; Manufacturer: Murata; Capacitance: 1µF; Case EIA: 0603; Case Metric: 1608; PnP Package: C_0603_10; PnP Value: 1.0µF/25V/X7R; Automotive Qualified: True; Rated Voltage: 25V; Dielectric: X7R; Supplier 1: Digi-Key; Supplier Part Number 1: 490-14409-1-ND; Height - Seated (Max): 0.8mm; Mounting Type: SurfaceMount,MLCC; Operating Temperature: –55 to 125°C; Series: GCJ; Tolerance: ±10%; Manufacturer_Part_Number: GCJ188R71E105KA01
D7 = CMP-2000-05929-1: Schottky Barrier Diode, 30 V, 200 mA, -65 to 125 degC, 3-Pin SOT323, RoHS, Tape and Reel; Unit Weight: 0.000212oz; Ifsm - Forward Surge Current: 0.6A; Vf - Forward Voltage: 1Vat0.1A; Brand: DiodesIncorporated; Pd - Power Dissipation: 200mW; Ir - Reverse Current: 2uAat25V; Type: SurfaceMountSchottkyBarrierDiodeArray; Vrrm - Repetitive Reverse Voltage: 30V; If - Forward Current: 0.2A; trr - Reverse Recovery time: 5ns; Configuration: DualSeries; Minimum Operating Temperature: -65C; Mounting Style: SMD/SMT; Manufacturer URL: http://www.diodes.com/; Mounting Technology: SurfaceMount; Packaging: Reel; Length: 2.2mm; Product Category: SchottkyDiodes&Rectifiers; Datasheet Version: Rev. 15-2, 03/2014; Series: BAT54; Operating Temperature Range: -65Cto+125C; Manufacturer: DiodesIncorporated; Technology: Si; Datasheet URL: http://www.diodes.com/_files/datasheets/ds30065.pdf; Height: 1mm; Width: 1.35mm; Termination Style: SMD/SMT; Maximum Operating Temperature: +125C; Product: SchottkyDiodes; Package / Case: SOT-323; Package Reference: SOT323; RoHS: True; Package Description: 3-Pin Small Outline Transistor, Body 2 x 1.25 mm, Pitch 0.65 mm; Factory Pack Quantity: 3000
D8-D11 = CDSOD323-T05: TVS Diode, CDSOD323 Series, Unidirectional, 5 V, 18.3 V, SOD-323, 2 Pins; Manufacturer: Bourns; Breakdown Voltage: 6V; Automotive Qualified: False; Part Number: CDSOD323-T05; Part Name: CDSOD323-T05; Operating Temperature: -55°C - +150°C; ComponentLink1Description: Datasheet; ComponentLink1URL: http://www.farnell.com/datasheets/1845299.pdf; Supplier 1: Farnell; Supplier Part Number 1: 2341914
L6-L11 L13 L14 = C5133952-28DE-41F1-874F-4A9C3E40D898: Chip Ferrite Bead for General Signal lines, 470 Ohm, 700 mA, -55 to 125 degC, 2 x 1.25 x 1.05 mm SMD, Tape and Reel; Manufacturer: Murata; DC Resistance: 0.19 Ohm Max.; Impedance (at 100 MHz): 470 Ohm +/- 25%; Rated Current: 700 mA; ComponentLink1URL: http://www.murata.com/; Packing: Tape and Reel; PackageDescription: 2-Pin Chip, Body 2 x 1.25 mm; ComponentLink3Description: Package Specification; Operating Temperature Range: -55 to 125 degC; ComponentLink1Description: Manufacturer URL; PartNumber: BLM21AG471SN1J; DatasheetVersion: 08/2013; Mounting Technology: Surface Mount; ComponentLink2URL: http://www.murata.com/products/catalog/pdf/c31e.pdf; ComponentLink3URL: http://www.murata.com/products/catalog/pdf/c31e.pdf; ComponentLink2Description: Datasheet; PackageReference: BLM21_H1050-2; Part Number: BLM21AG471SN1J
Q4 Q6 Q8 Q10 = BSS138: MOSFET, N-CH, 50V, 0.22A, SOT-23; Manufacturer: Fairchild Semiconductor; Alternate Manufacturer: None; U/M: EA; ChType: N; VdsMax_V: 50; Value1: 6 ohm; Rdson45_Ohm: 6; Value2: 1.7 nC; QgTyp_nC: 1.7; Vgs_V: 20; IdsMax_A: 0.22; ComponentLink1URL: http://www.fairchildsemi.com/ds/BS/BSS138.pdf; SymbolVersion: 2008-07-28; PackageReference: SOT-23; PartNumber: BSS138; ComponentLink1Description: Datasheet link; CompType: MOSFET; RoHS: Y; MountType: SMT; Published: 2008-06-19; Publisher: Texas Instruments; LatestRevisionDate: 2013-07-10; LatestRevisionNote: Added parts.; Supplier 1: Digi-Key; Supplier Part Number 1: BSS138CT-ND; Supplier 2: Mouser; Supplier Part Number 2: 512-BSS138; Supplier 3: Farnell; Supplier Part Number 3: 9845330
Q5 Q7 Q9 Q11 = CSD18543Q3A: 60V, N ch NexFET MOSFET™, single SON3x3, 9.9mOhm; Manufacturer: Texas Instruments; Alternate Manufacturer: None; CompType: MOSFET; Value: 30V; U/M: EA; VdsMax_V: 60; Value1: 0.0081 ohm; Rdson45_Ohm: 0.0081; Value2: 1.7 nC; QgTyp_nC: 1.7; Vgs_V: 10; IdsMax_A: 156; SymbolVersion: 2008-07-09; PartNumber: CSD18543Q3A; PackageReference: SON 3.3x3.3mm; ChType: N; RoHS: Y; MountType: SMT; Published: 2008-06-19; Publisher: Texas Instruments; LatestRevisionDate: 2013-07-24; LatestRevisionNote: Added parts.; ComponentLink1Description: Datasheet link; ComponentLink1URL: http://www.ti.com/lit/ds/symlink/csd18543q3a.pdf; Supplier 1: Digi-Key; Supplier 2: Digi-Key
R70 R73 R75 R79 R83 R92-R94 R96 R99 R101 = gen_R_10k_0603: as R35 on sheet interlock_circuit; Part Number: gen_R_10k_0603; Operating Temperature: -55°C - +155°C; Resistance: 10k; Series: E24, E96; PnP Value: 10k; Supplier 1: Farnell; Supplier Part Number 1: 2073349
R76 R77 R81 R82 R89 R90 R97 R98 = gen_R_47R_0603: SMD Resistor 47R 0603; Tolerance: 1%; Power: 0.1W; Case EIA: 0603; Case Metric: 1608; Maximum Working Voltage: 75V; PnP Package: R_0603; Automotive Qualified: False; Part Number: gen_R_47R_0603; Operating Temperature: -55°C - +155°C; Resistance: 47R; Series: E24; PnP Value: 47R; Supplier 1: Farnell; Supplier Part Number 1: 2303030
R88 R91 = gen_R_100k_0603: SMD Resistor 100k 0603; Case EIA: 0603; Case Metric: 1608; PnP Package: R_0603; Automotive Qualified: False; Operating Temperature: -55°C - +155°C; PnP Value: 100k; Part Number: gen_R_100k_0603
T4 = CMP-1099-00028-1: P-Channel SIPMOS Small-Signal-Transistor, -60 V VDS, -0.17 A ID, -55 to 150 degC, PG-SOT23, Reel, Green; Manufacturer: Infineon; VGS(th) (max): -2Â V; VGS(th) (min): -1Â V; VDS (max): -60Â V; Rth: 350Â K/W; Pto t (max): 0.36Â W; ID (max): -0.17Â A; IDpuls (max): -0.68Â A; RDS (on) (max) (@4.5V): 12,000Â mOhm; QG: 1Â nC; Green: TRUE; RDS (on) (max): 8,000Â mOhm; ComponentLink3URL: http://www.infineon.com/dgdl/SOT23-Package_Overview.pdf?folderId=db3a30431936bc4b0119532290053c66&fileId=db3a30431936bc4b0119533468123c85; ComponentLink3Description: Package Specification; Packing: Reel; PartNumber: BSS84P; ComponentLink2Description: Datasheet; Mounting Technology: Surface Mount; ComponentLink2URL: http://www.infineon.com/dgdl/BSS84P_Rev2.7%5B1%5D.pdf?folderId=db3a304314dca38901154a72e3951a65&fileId=db3a304330f68606013118ac7a9b4549; PackageReference: PG-SOT23; ComponentLink1URL: http://www.infineon.com/; PackageVersion: Apr-08; ComponentLink1Description: Manufacturer URL; PackageDescription: 3-Pin Small Outline Transistor Package, 2.9 x 1.3 mm Body, 0.95 mm Pitch; Halogen-free: TRUE; DatasheetVersion: Rev. 2.7
U23 U25 = ISO7761DWR: Imported; Manufacturer: Texas Instruments; PartNumber: ISO7761DWR; RefDes: RefDes; TYPE: TYPE; Value: Value
X11 = molex_microfit_3_08x2_THT: Micro-Fit 3.0 Right Angle Header, 3.00mm Pitch, Dual Row, 16 Circuits, with Snap-in Plastic Peg PCB Lock, Tin, Glow Wire Capable, Black, 43045-1600; Manufacturer: Molex; Circuits: 16; Rated Voltage: 600V; Rated Current: 8.5A; Automotive Qualified: False; Part Number: molex_microfit_3_08x2_THT; Part Name: MicroFit; Operating Temperature: -40°C - +105°C; Supplier 1: Digi-Key; Supplier 2: Digi-Key; Supplier Part Number 2: WM14573-ND